# EAGLE schematic PFCEDU.V4 (EAGLE 9.5.0)

## Sheet 1 of 7: Computer
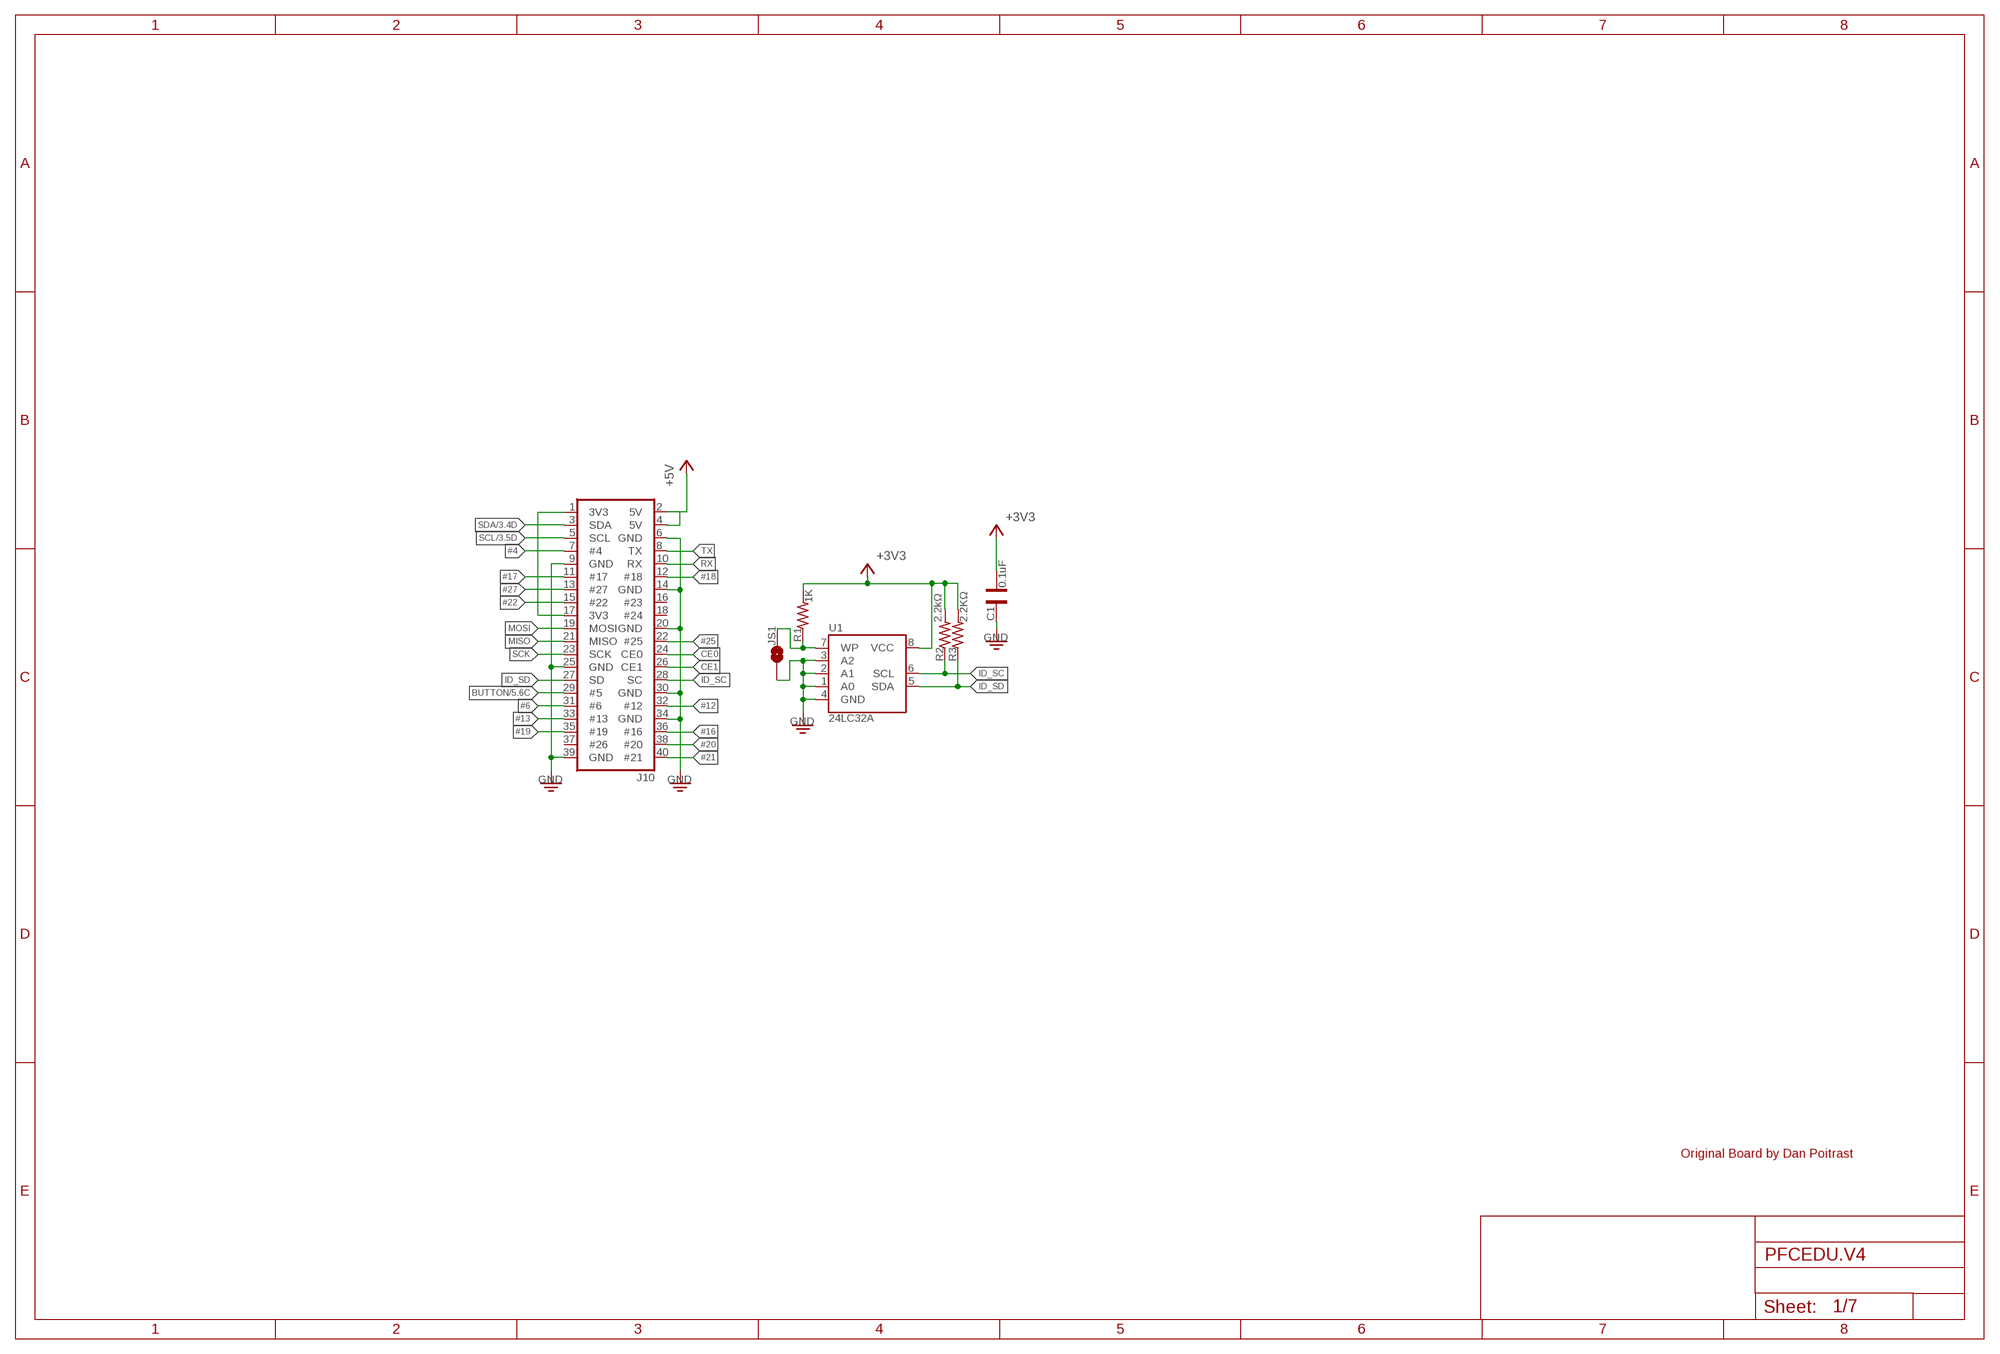
[diagram p0: schematic, sheet 1]

### Parts
C1  0.1uF  CAP0603  [CAP-0603]
J10  PFCEDU_V7_PI4_AI_CONNECTORS_2X20-RPI-NOFIRST  [PFCEDU_V7_PI4_AI_CONNECTORS_2X20-RPI-NOFIRST]
JS1  1X02-SJ-NO  [1X02-SJ-NO]
R1  1K  RES0603  [RES-0603]
R2  2.2kΩ  RES0603  [RES-0603]
R3  2.2KΩ  RES0603  [RES-0603]
U1  24LC32A  [SO08-EIAJ]

### Nets
#4: J10.7(#4)
#6: J10.31(#6)
#12: J10.32(#12)
#13: J10.33(#13)
#16: J10.36(#16)
#17: J10.11(#17)
#18: J10.12(#18)
#19: J10.35(#19)
#20: J10.38(#20)
#21: J10.40(#21)
#22: J10.15(#22)
#25: J10.22(#25)
#27: J10.13(#27)
+3V3: C1.1 R1.2 R2.2 R3.2 U1.8(VCC) ; also sheet 3,4,5,6,7
+5V: J10.2(5V) J10.4(5V) ; also sheet 3,4,7
BUTTON: J10.29(#5) ; also sheet 5
CE0: J10.24(CE0)
CE1: J10.26(CE1)
GND: C1.2 J10.6(GND) J10.9(GND) J10.14(GND) J10.20(GND) J10.25(GND) J10.30(GND) J10.34(GND) J10.39(GND) JS1.1 U1.1(A0) U1.2(A1) U1.3(A2) U1.4(GND) ; also sheet 2,3,4,5,6,7
ID_SC: J10.28(SC) R2.1 U1.6(SCL)
ID_SD: J10.27(SD) R3.1 U1.5(SDA)
MISO: J10.21(MISO)
MOSI: J10.19(MOSI)
N$41: J10.1(3V3) J10.17(3V3)
N$77: JS1.2 R1.1 U1.7(WP)
RX: J10.10(RX)
SCK: J10.23(SCK)
SCL: J10.5(SCL) ; also sheet 3
SDA: J10.3(SDA) ; also sheet 3
TX: J10.8(TX)
Unconnected: J10.16(#23) J10.18(#24) J10.37(#26)

### Notes on the sheet
- Original Board by Dan Poitrast

## Sheet 2 of 7: LED Circuitry
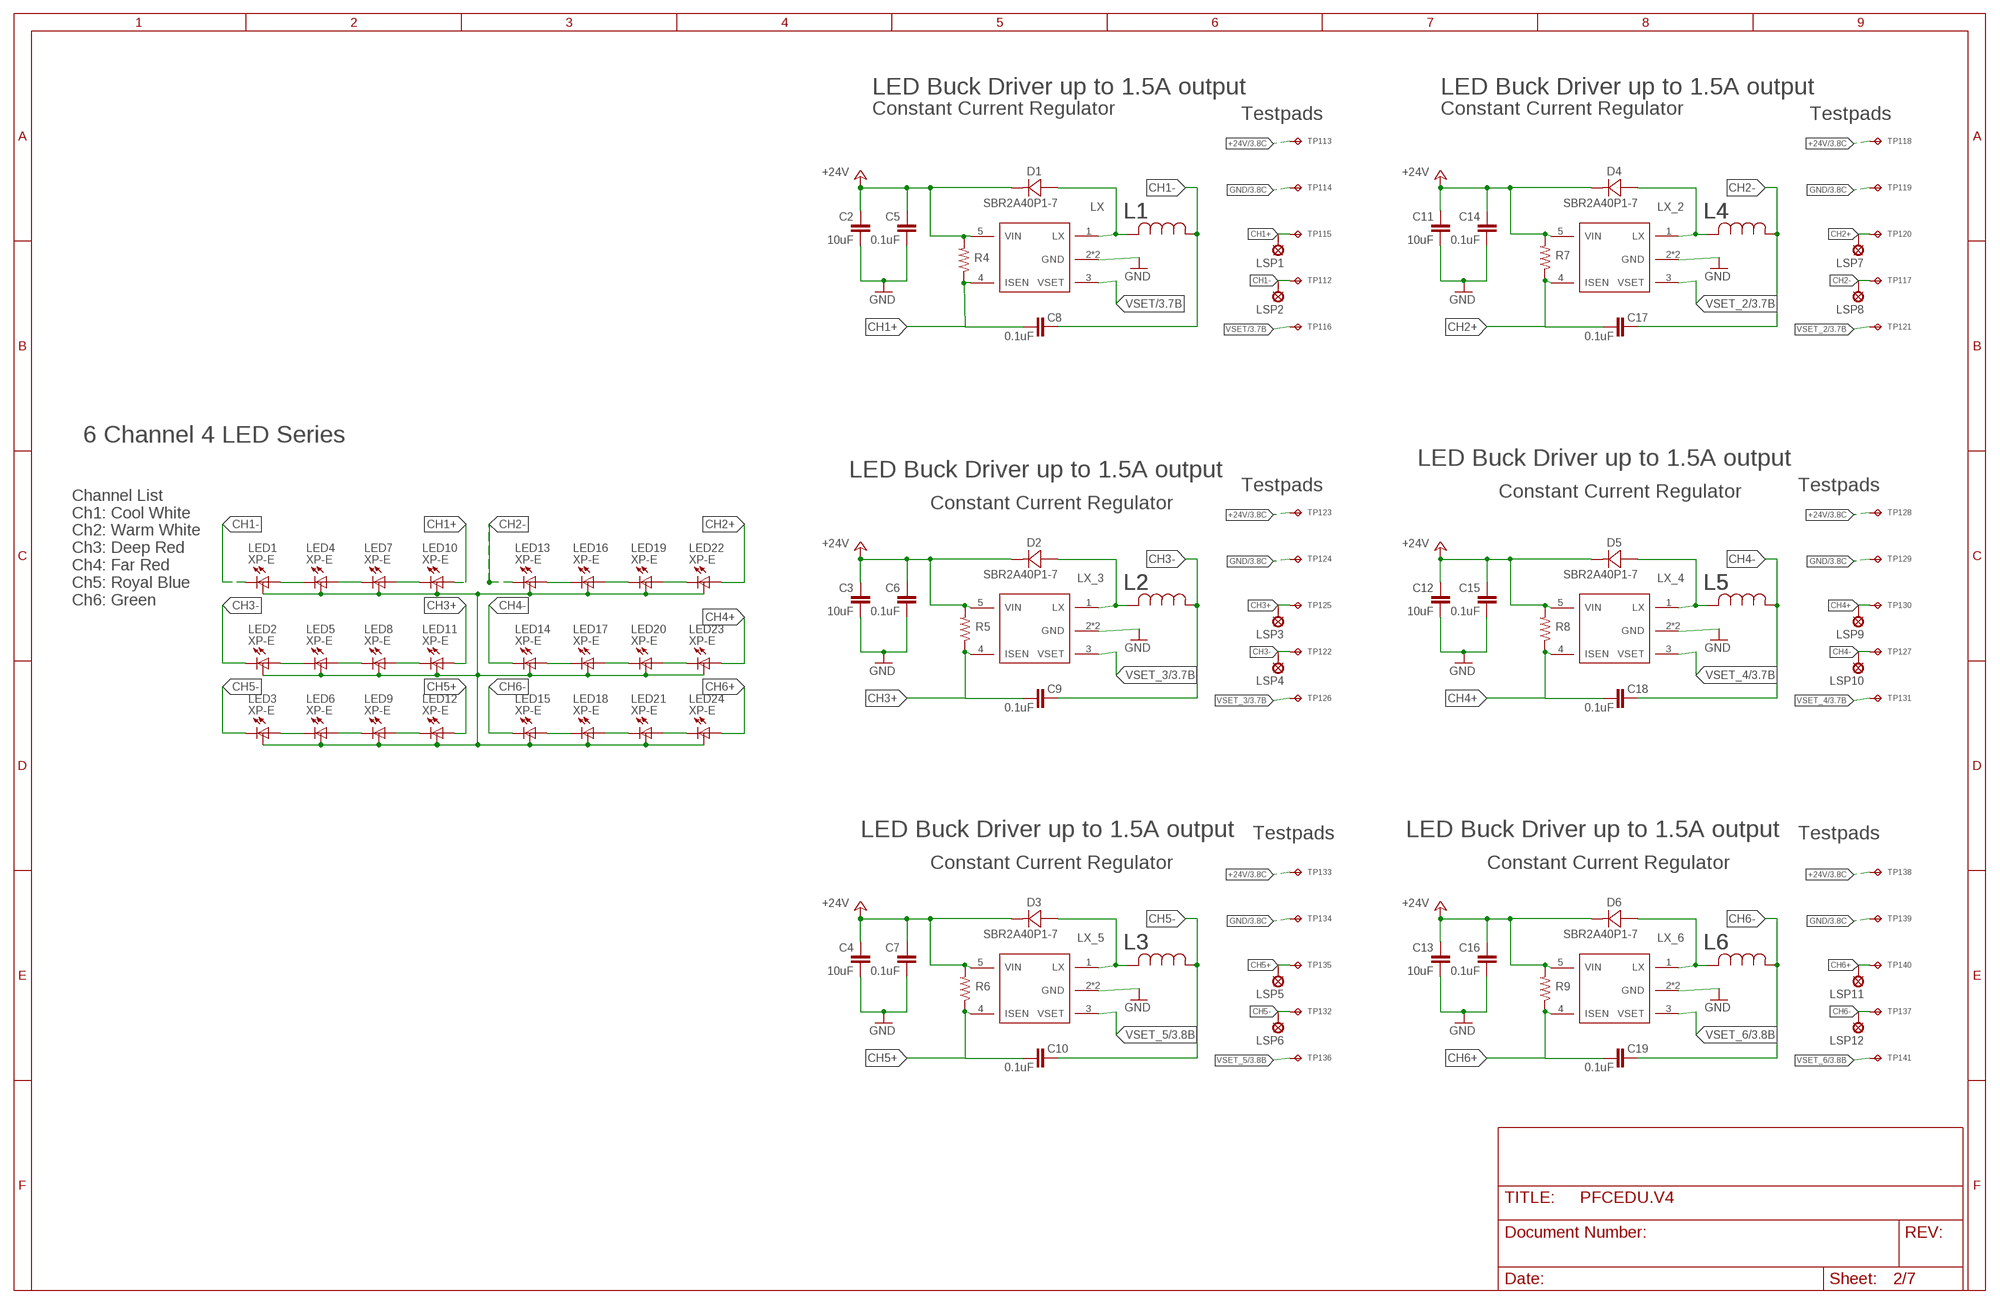
[diagram p1: schematic, sheet 2]

### Parts
C2  10uF  10UF-GMK212BBJ106KG-T  [C0805]
C3  10uF  10UF-GMK212BBJ106KG-T  [C0805]
C4  10uF  10UF-GMK212BBJ106KG-T  [C0805]
C5  0.1uF  0.1UF-C0603C104K5RACTU  [C0603]
C6  0.1uF  0.1UF-C0603C104K5RACTU  [C0603]
C7  0.1uF  0.1UF-C0603C104K5RACTU  [C0603]
C8  0.1uF  0.1UF-C0603C104K5RACTU  [C0603]
C9  0.1uF  0.1UF-C0603C104K5RACTU  [C0603]
C10  0.1uF  0.1UF-C0603C104K5RACTU  [C0603]
C11  10uF  10UF-GMK212BBJ106KG-T  [C0805]
C12  10uF  10UF-GMK212BBJ106KG-T  [C0805]
C13  10uF  10UF-GMK212BBJ106KG-T  [C0805]
C14  0.1uF  0.1UF-C0603C104K5RACTU  [C0603]
C15  0.1uF  0.1UF-C0603C104K5RACTU  [C0603]
C16  0.1uF  0.1UF-C0603C104K5RACTU  [C0603]
C17  0.1uF  0.1UF-C0603C104K5RACTU  [C0603]
C18  0.1uF  0.1UF-C0603C104K5RACTU  [C0603]
C19  0.1uF  0.1UF-C0603C104K5RACTU  [C0603]
D1  SBR2A40P1-7  [POWERDI123]
D2  SBR2A40P1-7  [POWERDI123]
D3  SBR2A40P1-7  [POWERDI123]
D4  SBR2A40P1-7  [POWERDI123]
D5  SBR2A40P1-7  [POWERDI123]
D6  SBR2A40P1-7  [POWERDI123]
L1  NR8040T101M  [IND_TAIYO_NR8040]
L2  NR8040T101M  [IND_TAIYO_NR8040]
L3  NR8040T101M  [IND_TAIYO_NR8040]
L4  NR8040T101M  [IND_TAIYO_NR8040]
L5  NR8040T101M  [IND_TAIYO_NR8040]
L6  NR8040T101M  [IND_TAIYO_NR8040]
LED1  XP-E  LED_W/THERM-XP-E  [CREE-XLAMP-XP-E]
LED2  XP-E  LED_W/THERM-XP-E  [CREE-XLAMP-XP-E]
LED3  XP-E  LED_W/THERM-XP-E  [CREE-XLAMP-XP-E]
LED4  XP-E  LED_W/THERM-XP-E  [CREE-XLAMP-XP-E]
LED5  XP-E  LED_W/THERM-XP-E  [CREE-XLAMP-XP-E]
LED6  XP-E  LED_W/THERM-XP-E  [CREE-XLAMP-XP-E]
LED7  XP-E  LED_W/THERM-XP-E  [CREE-XLAMP-XP-E]
LED8  XP-E  LED_W/THERM-XP-E  [CREE-XLAMP-XP-E]
LED9  XP-E  LED_W/THERM-XP-E  [CREE-XLAMP-XP-E]
LED10  XP-E  LED_W/THERM-XP-E  [CREE-XLAMP-XP-E]
LED11  XP-E  LED_W/THERM-XP-E  [CREE-XLAMP-XP-E]
LED12  XP-E  LED_W/THERM-XP-E  [CREE-XLAMP-XP-E]
LED13  XP-E  LED_W/THERM-XP-E  [CREE-XLAMP-XP-E]
LED14  XP-E  LED_W/THERM-XP-E  [CREE-XLAMP-XP-E]
LED15  XP-E  LED_W/THERM-XP-E  [CREE-XLAMP-XP-E]
LED16  XP-E  LED_W/THERM-XP-E  [CREE-XLAMP-XP-E]
LED17  XP-E  LED_W/THERM-XP-E  [CREE-XLAMP-XP-E]
LED18  XP-E  LED_W/THERM-XP-E  [CREE-XLAMP-XP-E]
LED19  XP-E  LED_W/THERM-XP-E  [CREE-XLAMP-XP-E]
LED20  XP-E  LED_W/THERM-XP-E  [CREE-XLAMP-XP-E]
LED21  XP-E  LED_W/THERM-XP-E  [CREE-XLAMP-XP-E]
LED22  XP-E  LED_W/THERM-XP-E  [CREE-XLAMP-XP-E]
LED23  XP-E  LED_W/THERM-XP-E  [CREE-XLAMP-XP-E]
LED24  XP-E  LED_W/THERM-XP-E  [CREE-XLAMP-XP-E]
LSP1  SE14  [SE14]
LSP2  SE14  [SE14]
LSP3  SE14  [SE14]
LSP4  SE14  [SE14]
LSP5  SE14  [SE14]
LSP6  SE14  [SE14]
LSP7  SE14  [SE14]
LSP8  SE14  [SE14]
LSP9  SE14  [SE14]
LSP10  SE14  [SE14]
LSP11  SE14  [SE14]
LSP12  SE14  [SE14]
R4  6.34 ohm  6.3OHM-RC0805FR-076R34L  [R0805]
R5  6.34 ohm  6.3OHM-RC0805FR-076R34L  [R0805]
R6  6.34 ohm  6.3OHM-RC0805FR-076R34L  [R0805]
R7  6.34 ohm  6.3OHM-RC0805FR-076R34L  [R0805]
R8  6.34 ohm  6.3OHM-RC0805FR-076R34L  [R0805]
R9  6.34 ohm  6.3OHM-RC0805FR-076R34L  [R0805]
TP112  TPTP06R  [TP06R]
TP113  TPTP06R  [TP06R]
TP114  TPTP06R  [TP06R]
TP115  TPTP06R  [TP06R]
TP116  TPTP06R  [TP06R]
TP117  TPTP06R  [TP06R]
TP118  TPTP06R  [TP06R]
TP119  TPTP06R  [TP06R]
TP120  TPTP06R  [TP06R]
TP121  TPTP06R  [TP06R]
TP122  TPTP06R  [TP06R]
TP123  TPTP06R  [TP06R]
TP124  TPTP06R  [TP06R]
TP125  TPTP06R  [TP06R]
TP126  TPTP06R  [TP06R]
TP127  TPTP06R  [TP06R]
TP128  TPTP06R  [TP06R]
TP129  TPTP06R  [TP06R]
TP130  TPTP06R  [TP06R]
TP131  TPTP06R  [TP06R]
TP132  TPTP06R  [TP06R]
TP133  TPTP06R  [TP06R]
TP134  TPTP06R  [TP06R]
TP135  TPTP06R  [TP06R]
TP136  TPTP06R  [TP06R]
TP137  TPTP06R  [TP06R]
TP138  TPTP06R  [TP06R]
TP139  TPTP06R  [TP06R]
TP140  TPTP06R  [TP06R]
TP141  TPTP06R  [TP06R]
U2  AL8861  [AL8861]
U3  AL8861  [AL8861]
U4  AL8861  [AL8861]
U5  AL8861  [AL8861]
U6  AL8861  [AL8861]
U7  AL8861  [AL8861]

### Nets
+24V: C2.1 C3.1 C4.1 C5.1 C6.1 C7.1 C11.1 C12.1 C13.1 C14.1 C15.1 C16.1 D1.- D2.- D3.- D4.- D5.- D6.- R4.2 R5.2 R6.2 R7.2 R8.2 R9.2 TP113.TP TP118.TP TP123.TP TP128.TP TP133.TP TP138.TP U2.5(VIN) U3.5(VIN) U4.5(VIN) U5.5(VIN) U6.5(VIN) U7.5(VIN) ; also sheet 3,4,5,7
CH1+: C8.2 LED10.A LED10.A@1(A) LSP1.MP R4.1 TP115.TP U2.4(ISEN)
CH1-: C8.1 L1.1 LED1.C LED1.C@1(C) LSP2.MP TP112.TP
CH2+: C17.2 LED22.A LED22.A@1(A) LSP7.MP R7.1 TP120.TP U5.4(ISEN)
CH2-: C17.1 L4.1 LED13.C LED13.C@1(C) LSP8.MP TP117.TP
CH3+: C9.2 LED11.A LED11.A@1(A) LSP3.MP R5.1 TP125.TP U3.4(ISEN)
CH3-: C9.1 L2.1 LED2.C LED2.C@1(C) LSP4.MP TP122.TP
CH4+: C18.2 LED23.A LED23.A@1(A) LSP9.MP R8.1 TP130.TP U6.4(ISEN)
CH4-: C18.1 L5.1 LED14.C LED14.C@1(C) LSP10.MP TP127.TP
CH5+: C10.2 LED12.A LED12.A@1(A) LSP5.MP R6.1 TP135.TP U4.4(ISEN)
CH5-: C10.1 L3.1 LED3.C LED3.C@1(C) LSP6.MP TP132.TP
CH6+: C19.2 LED24.A LED24.A@1(A) LSP11.MP R9.1 TP140.TP U7.4(ISEN)
CH6-: C19.1 L6.1 LED15.C LED15.C@1(C) LSP12.MP TP137.TP
GND: C2.2 C3.2 C4.2 C5.2 C6.2 C7.2 C11.2 C12.2 C13.2 C14.2 C15.2 C16.2 TP114.TP TP119.TP TP124.TP TP129.TP TP134.TP TP139.TP U2.2(GND) U2.44(GND) U3.2(GND) U3.44(GND) U4.2(GND) U4.44(GND) U5.2(GND) U5.44(GND) U6.2(GND) U6.44(GND) U7.2(GND) U7.44(GND) ; also sheet 1,3,4,5,6,7
LX: D1.+ L1.2 U2.1(LX)
LX_2: D4.+ L4.2 U5.1(LX)
LX_3: D2.+ L2.2 U3.1(LX)
LX_4: D5.+ L5.2 U6.1(LX)
LX_5: D3.+ L3.2 U4.1(LX)
LX_6: D6.+ L6.2 U7.1(LX)
N$29: LED13.A LED13.A@1(A) LED16.C LED16.C@1(C)
N$31: LED16.A LED16.A@1(A) LED19.C LED19.C@1(C)
N$32: LED19.A LED19.A@1(A) LED22.C LED22.C@1(C)
N$33: LED14.A LED14.A@1(A) LED17.C LED17.C@1(C)
N$34: LED17.A LED17.A@1(A) LED20.C LED20.C@1(C)
N$35: LED20.A LED20.A@1(A) LED23.C LED23.C@1(C)
N$36: LED15.A LED15.A@1(A) LED18.C LED18.C@1(C)
N$37: LED18.A LED18.A@1(A) LED21.C LED21.C@1(C)
N$46: LED21.A LED21.A@1(A) LED24.C LED24.C@1(C)
N$47: LED1.A LED1.A@1(A) LED4.C LED4.C@1(C)
N$48: LED4.A LED4.A@1(A) LED7.C LED7.C@1(C)
N$81: LED7.A LED7.A@1(A) LED10.C LED10.C@1(C)
N$82: LED2.A LED2.A@1(A) LED5.C LED5.C@1(C)
N$83: LED5.A LED5.A@1(A) LED8.C LED8.C@1(C)
N$84: LED8.A LED8.A@1(A) LED11.C LED11.C@1(C)
N$85: LED3.A LED3.A@1(A) LED6.C LED6.C@1(C)
N$159: LED6.A LED6.A@1(A) LED9.C LED9.C@1(C)
N$160: LED9.A LED9.A@1(A) LED12.C LED12.C@1(C)
T1: LED1.THERM LED2.THERM LED3.THERM LED4.THERM LED5.THERM LED6.THERM LED7.THERM LED8.THERM LED9.THERM LED10.THERM LED11.THERM LED12.THERM LED13.THERM LED14.THERM LED15.THERM LED16.THERM LED17.THERM LED18.THERM LED19.THERM LED20.THERM LED21.THERM LED22.THERM LED23.THERM LED24.THERM
VSET: TP116.TP U2.3(VSET) ; also sheet 3
VSET_2: TP121.TP U5.3(VSET) ; also sheet 3
VSET_3: TP126.TP U3.3(VSET) ; also sheet 3
VSET_4: TP131.TP U6.3(VSET) ; also sheet 3
VSET_5: TP136.TP U4.3(VSET) ; also sheet 3
VSET_6: TP141.TP U7.3(VSET) ; also sheet 3

### Notes on the sheet
- LED Buck Driver up to 1.5A output | LED Buck Driver up to 1.5A output
- Constant Current Regulator | Testpads | Constant Current Regulator | Testpads
- 6 Channel 4 LED Series
- LED Buck Driver up to 1.5A output
- LED Buck Driver up to 1.5A output
- Testpads | Testpads
- Constant Current Regulator
- Constant Current Regulator
- Channel List
  Ch1: Cool White
  Ch2: Warm White
  Ch3: Deep Red
  Ch4: Far Red
  Ch5: Royal Blue
  Ch6: Green
- LED Buck Driver up to 1.5A output | Testpads | LED Buck Driver up to 1.5A output | Testpads
- Constant Current Regulator | Constant Current Regulator

## Sheet 3 of 7: Control Circuitry
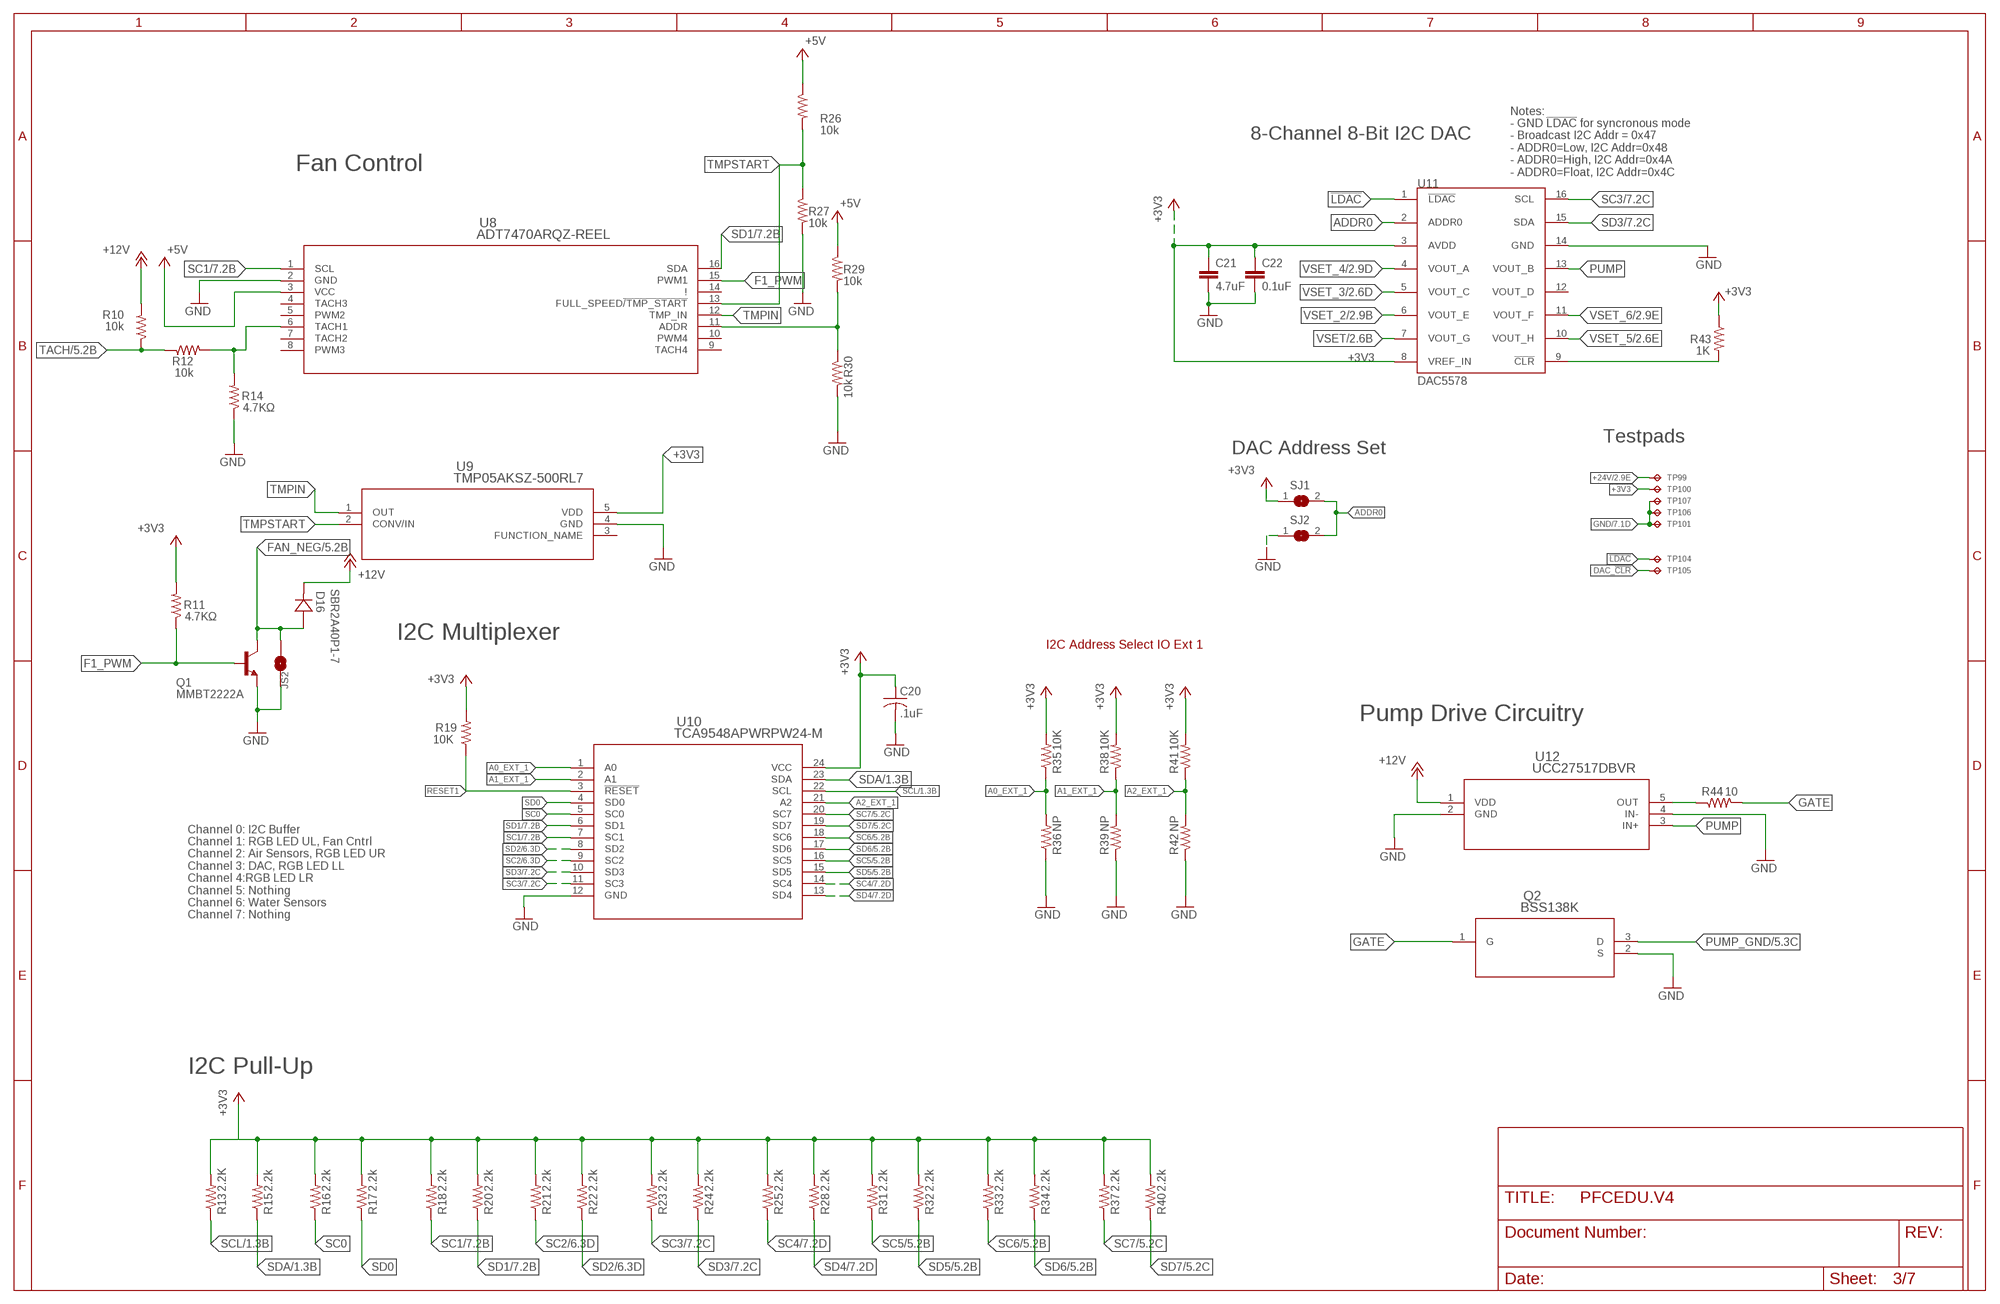
[diagram p2: schematic, sheet 3]

### Parts
C20  .1uF  C-USC0603  [C0603@1]
C21  4.7uF  4.7UF-CL21A475KBQNNNE  [C0805]
C22  0.1uF  0.1UF-C0603C104K5RACTU  [C0603]
D16  SBR2A40P1-7  [POWERDI123]
JS2  1X02-SJ-NO  [1X02-SJ-NO]
Q1  MMBT2222A  BCF30SMD  [SOT23-BEC]
Q2  BSS138K  DMN6140L-13  [SOT-23]
R10  10k  10KOHM-1/10W-1%(0603)0603  [0603-RES]
R11  4.7KΩ  10KOHM-1/10W-1%(0603)0603  [0603-RES]
R12  10k  10KOHM-1/10W-1%(0603)0603  [0603-RES]
R13  2.2K  10KOHM-1/10W-1%(0603)0603  [0603-RES]
R14  4.7KΩ  10KOHM-1/10W-1%(0603)0603  [0603-RES]
R15  2.2k  10KOHM-1/10W-1%(0603)0603  [0603-RES]
R16  2.2k  10KOHM-1/10W-1%(0603)0603  [0603-RES]
R17  2.2k  10KOHM-1/10W-1%(0603)0603  [0603-RES]
R18  2.2k  10KOHM-1/10W-1%(0603)0603  [0603-RES]
R19  10K  R-US_R0603  [R0603]
R20  2.2k  10KOHM-1/10W-1%(0603)0603  [0603-RES]
R21  2.2k  10KOHM-1/10W-1%(0603)0603  [0603-RES]
R22  2.2k  10KOHM-1/10W-1%(0603)0603  [0603-RES]
R23  2.2k  10KOHM-1/10W-1%(0603)0603  [0603-RES]
R24  2.2k  10KOHM-1/10W-1%(0603)0603  [0603-RES]
R25  2.2k  10KOHM-1/10W-1%(0603)0603  [0603-RES]
R26  10k  10KOHM-1/10W-1%(0603)0603  [0603-RES]
R27  10k  10KOHM-1/10W-1%(0603)0603  [0603-RES]
R28  2.2k  10KOHM-1/10W-1%(0603)0603  [0603-RES]
R29  10k  10KOHM-1/10W-1%(0603)0603  [0603-RES]
R30  10k  10KOHM-1/10W-1%(0603)0603  [0603-RES]
R31  2.2k  10KOHM-1/10W-1%(0603)0603  [0603-RES]
R32  2.2k  10KOHM-1/10W-1%(0603)0603  [0603-RES]
R33  2.2k  10KOHM-1/10W-1%(0603)0603  [0603-RES]
R34  2.2k  10KOHM-1/10W-1%(0603)0603  [0603-RES]
R35  10K  10KOHM-1/10W-1%(0603)0603  [0603-RES]
R36  NP  10KOHM-1/10W-1%(0603)0603  [0603-RES]
R37  2.2k  10KOHM-1/10W-1%(0603)0603  [0603-RES]
R38  10K  10KOHM-1/10W-1%(0603)0603  [0603-RES]
R39  NP  10KOHM-1/10W-1%(0603)0603  [0603-RES]
R40  2.2k  10KOHM-1/10W-1%(0603)0603  [0603-RES]
R41  10K  10KOHM-1/10W-1%(0603)0603  [0603-RES]
R42  NP  10KOHM-1/10W-1%(0603)0603  [0603-RES]
R43  1K  1K-ERJ-PB3D1001V  [RC0603N]
R44  10  10KOHM-1/10W-1%(0603)0603  [0603-RES]
SJ1  SOLDERJUMPERREFLOW_NOPASTE  [SJ1]
SJ2  SOLDERJUMPERREFLOW_NOPASTE  [SJ1]
TP99  TPTP04R  [TP04R]
TP100  TPTP04R  [TP04R]
TP101  TPTP04R  [TP04R]
TP104  TPTP04R  [TP04R]
TP105  TPTP04R  [TP04R]
TP106  TPTP04R  [TP04R]
TP107  TPTP04R  [TP04R]
U8  ADT7470ARQZ-REEL  [RQ_16]
U9  TMP05AKSZ-500RL7  [KS_5]
U10  TCA9548APWRPW24-M  [PW24-M]
U11  DAC5578  DAC5578SPW  [TSSOP16]
U12  UCC27517DBVR  [DBV5]

### Nets
!LDAC!: TP104.1(TP) U11.1(!LDAC!)
+3V3: C20.1 C21.1 C22.1 R11.2 R13.2 R15.2 R16.2 R17.2 R18.2 R19.2 R20.2 R21.2 R22.2 R23.2 R24.2 R25.2 R28.2 R31.2 R32.2 R33.2 R34.2 R35.2 R37.2 R38.2 R40.2 R41.2 R43.1 SJ1.1 TP100.1(TP) U9.5(VDD) U10.24(VCC) U11.3(AVDD) U11.8(VREF_IN) ; also sheet 1,4,5,6,7
+5V: R26.1 R29.1 U8.3(VCC) ; also sheet 1,4,7
+12V: D16.- R10.2 U12.1(VDD) ; also sheet 4,5,7
+24V: TP99.1(TP) ; also sheet 2,4,5,7
A0_EXT_1: R35.1 R36.2 U10.1(A0)
A1_EXT_1: R38.1 R39.2 U10.2(A1)
A2_EXT_1: R41.1 R42.2 U10.21(A2)
ADDR0: SJ1.2 SJ2.2 U11.2(ADDR0)
DAC_!CLR!: R43.2 TP105.1(TP) U11.9(!CLR!)
F1_PWM: Q1.B R11.1 U8.15(PWM1)
FAN_NEG: D16.+ JS2.1 Q1.C ; also sheet 5
GATE: Q2.1(G) R44.2
GND: C20.2 C21.2 C22.2 JS2.2 Q1.E Q2.2(S) R14.1 R27.2 R30.2 R36.1 R39.1 R42.1 SJ2.1 TP101.1(TP) TP106.1(TP) TP107.1(TP) U8.2(GND) U9.4(GND) U10.12(GND) U11.14(GND) U12.2(GND) U12.4(IN-) ; also sheet 1,2,4,5,6,7
N$38: R29.2 R30.1 U8.11(ADDR)
N$40: R12.2 R14.2 U8.6(TACH1)
N$75: R44.1 U12.5(OUT)
PUMP: U11.13(VOUT_B) U12.3(IN+)
PUMP_GND: Q2.3(D) ; also sheet 5
RESET1: R19.1 U10.3(!RESET)
SC0: R16.1 U10.5(SC0)
SC1: R18.1 U8.1(SCL) U10.7(SC1) ; also sheet 7
SC2: R21.1 U10.9(SC2) ; also sheet 6,7
SC3: R23.1 U10.11(SC3) U11.16(SCL) ; also sheet 7
SC4: R25.1 U10.14(SC4) ; also sheet 7
SC5: R31.1 U10.16(SC5) ; also sheet 5
SC6: R33.1 U10.18(SC6) ; also sheet 5,6
SC7: R37.1 U10.20(SC7) ; also sheet 5
SCL: R13.1 U10.22(SCL) ; also sheet 1
SD0: R17.1 U10.4(SD0)
SD1: R20.1 U8.16(SDA) U10.6(SD1) ; also sheet 7
SD2: R22.1 U10.8(SD2) ; also sheet 6,7
SD3: R24.1 U10.10(SD3) U11.15(SDA) ; also sheet 7
SD4: R28.1 U10.13(SD4) ; also sheet 7
SD5: R32.1 U10.15(SD5) ; also sheet 5
SD6: R34.1 U10.17(SD6) ; also sheet 5,6
SD7: R40.1 U10.19(SD7) ; also sheet 5
SDA: R15.1 U10.23(SDA) ; also sheet 1
TACH: R10.1 R12.1 ; also sheet 5
TMPIN: U8.12(TMP_IN) U9.1(OUT)
TMPSTART: R26.2 R27.1 U8.13(FULL_SPEED!/TMP_START) U9.2(CONV/IN)
VSET: U11.7(VOUT_G) ; also sheet 2
VSET_2: U11.6(VOUT_E) ; also sheet 2
VSET_3: U11.5(VOUT_C) ; also sheet 2
VSET_4: U11.4(VOUT_A) ; also sheet 2
VSET_5: U11.10(VOUT_H) ; also sheet 2
VSET_6: U11.11(VOUT_F) ; also sheet 2
Unconnected: U8.4(TACH3) U8.5(PWM2) U8.7(TACH2) U8.8(PWM3) U8.9(TACH4) U8.10(PWM4) U8.14(!) U9.3(FUNCTION_NAME) U11.12(VOUT_D)

### Notes on the sheet
- 8-Channel 8-Bit I2C DAC
- Fan Control
- Notes:
  - GND !LDAC! for syncronous mode
  - Broadcast I2C Addr = 0x47
  - ADDR0=Low, I2C Addr=0x48
  - ADDR0=High, I2C Addr=0x4A
  - ADDR0=Float, I2C Addr=0x4C
- Testpads
- DAC Address Set
- I2C Multiplexer | I2C Address Select IO Ext 1
- Pump Drive Circuitry
- Channel 0: I2C Buffer
  Channel 1: RGB LED UL, Fan Cntrl
  Channel 2: Air Sensors, RGB LED UR
  Channel 3: DAC, RGB LED LL
  Channel 4:RGB LED LR
  Channel 5: Nothing
  Channel 6: Water Sensors
  Channel 7: Nothing
- I2C Pull-Up

## Sheet 4 of 7: Power Supply
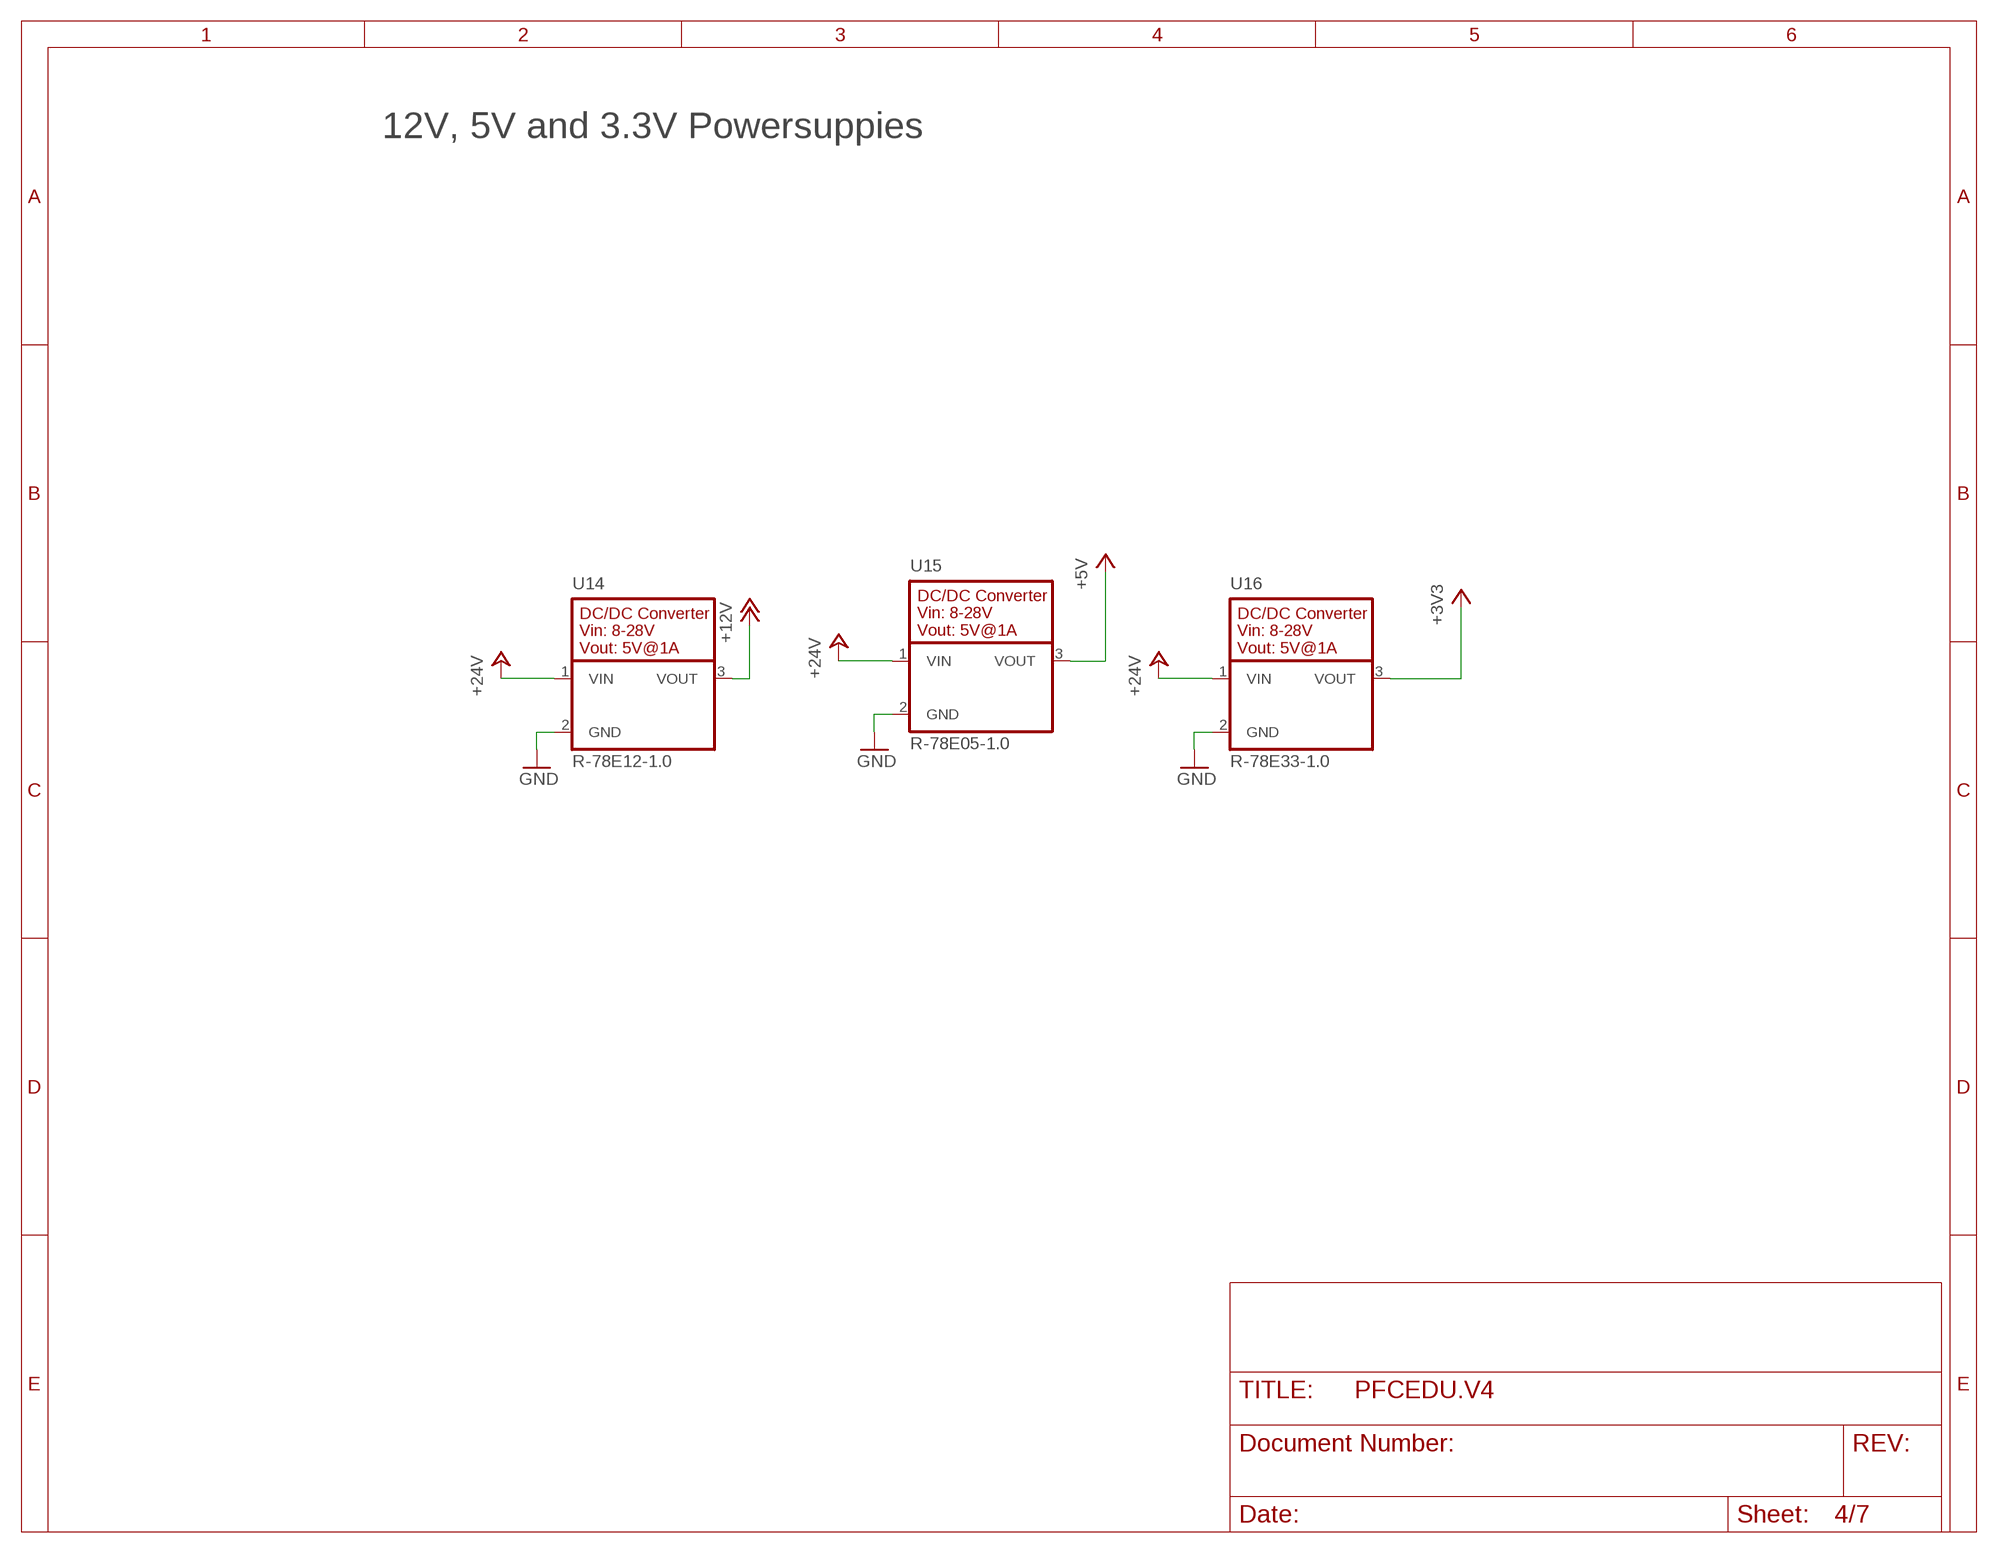
[diagram p3: schematic, sheet 4]

### Parts
U14  R-78E12-1.0  R-78E5.0-1.0  [R-78E5.0-1.0]
U15  R-78E05-1.0  R-78E5.0-1.0  [R-78E5.0-1.0]
U16  R-78E33-1.0  R-78E5.0-1.0  [R-78E5.0-1.0]

### Nets
+3V3: U16.3(VOUT) ; also sheet 1,3,5,6,7
+5V: U15.3(VOUT) ; also sheet 1,3,7
+12V: U14.3(VOUT) ; also sheet 3,5,7
+24V: U14.1(VIN) U15.1(VIN) U16.1(VIN) ; also sheet 2,3,5,7
GND: U14.2(GND) U15.2(GND) U16.2(GND) ; also sheet 1,2,3,5,6,7

### Notes on the sheet
- 12V, 5V and 3.3V Powersuppies

## Sheet 5 of 7: Connectors
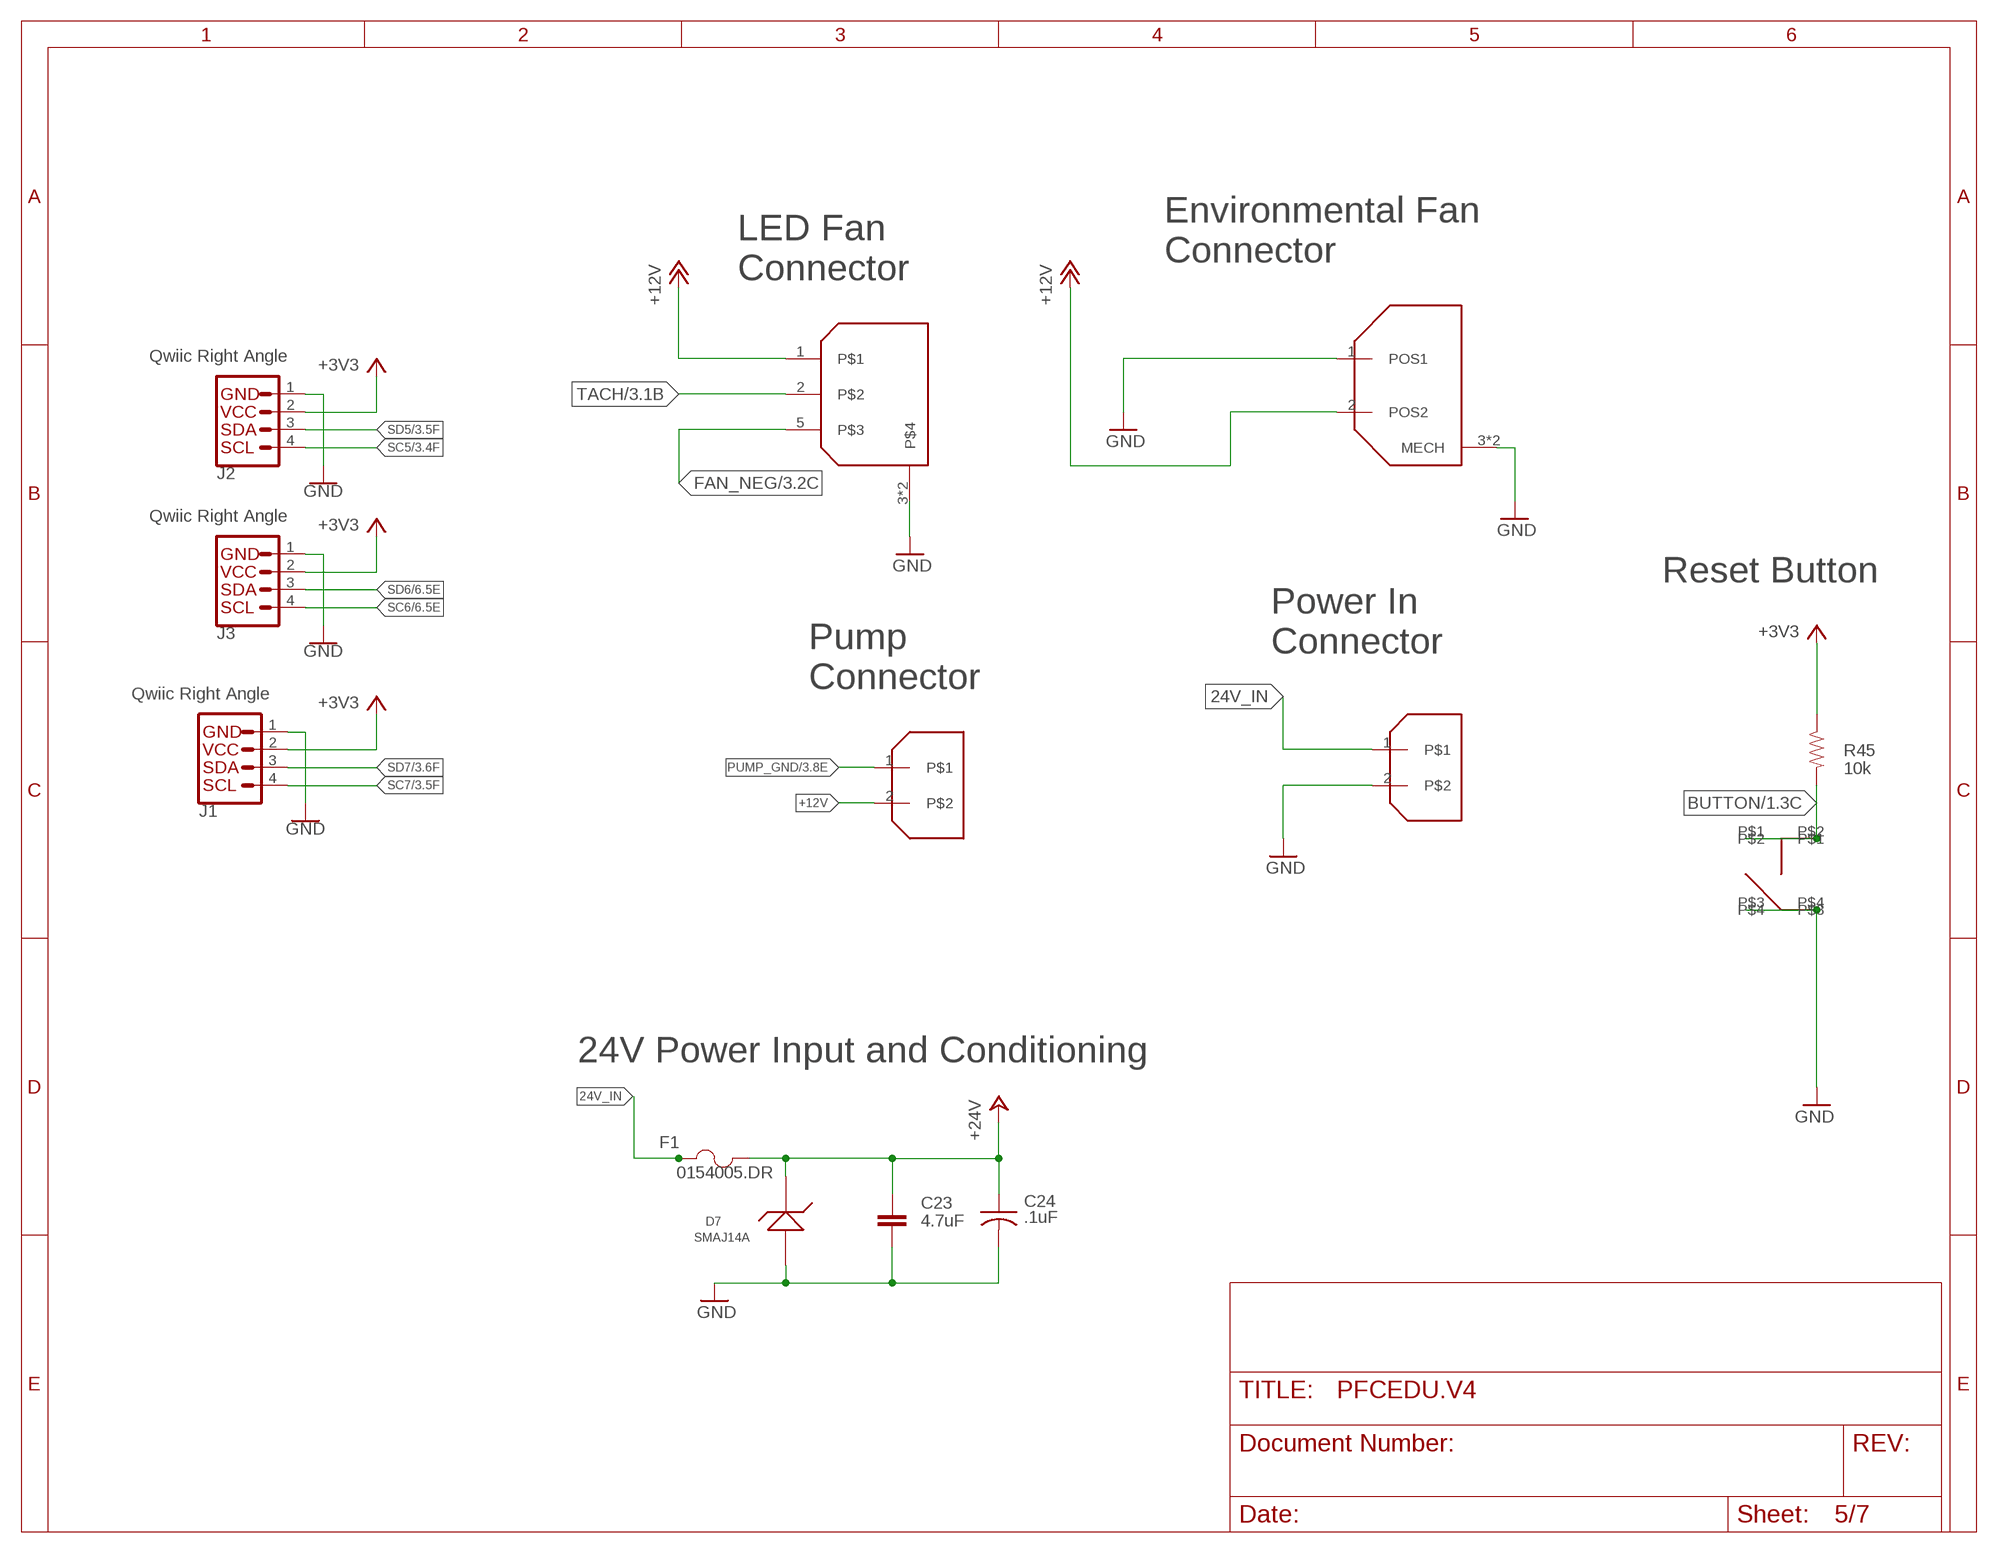
[diagram p4: schematic, sheet 5]

### Parts
A1  PTS645  [PTS645]
C23  4.7uF  4.7UF-CL21A475KBQNNNE  [C0805]
C24  .1uF  C-USC0603  [C0603@1]
D7  SMAJ14A  [DO-214AC]
F1  0154005.DR  [0154SERIES]
J1  Qwiic Right Angle  I2C_STANDARDQWIIC  [1X04_1MM_RA]
J2  Qwiic Right Angle  I2C_STANDARDQWIIC  [1X04_1MM_RA]
J3  Qwiic Right Angle  I2C_STANDARDQWIIC  [1X04_1MM_RA]
J11  MOLEX_2P_1.25MM  [MOLEX_2P_1.25MM]
J12  MOLEX_3P_1.25MM  [MOLEX_3P_1.25MM]
R45  10k  10KOHM-1/10W-1%(0603)0603  [0603-RES]
W11  PHOENIX_2P  [PHOENIX_2P]
W12  PHOENIX_2P  [PHOENIX_2P]

### Nets
24V_IN: F1.1 W12.1
+3V3: J1.2 J2.2 J3.2 R45.1 ; also sheet 1,3,4,6,7
+12V: J11.2(POS2) J12.1 W11.2 ; also sheet 3,4,7
+24V: C23.1 C24.1 D7.C F1.2 ; also sheet 2,3,4,7
BUTTON: A1.P$1 A1.P$2 R45.2 ; also sheet 1
FAN_NEG: J12.5 ; also sheet 3
GND: A1.P$3 A1.P$4 C23.2 C24.2 D7.A J1.1 J2.1 J3.1 J11.1(POS1) J11.3(MECH) J11.4(MECH) J12.3 J12.4 W12.2 ; also sheet 1,2,3,4,6,7
PUMP_GND: W11.1 ; also sheet 3
SC5: J2.4 ; also sheet 3
SC6: J3.4 ; also sheet 3,6
SC7: J1.4 ; also sheet 3
SD5: J2.3 ; also sheet 3
SD6: J3.3 ; also sheet 3,6
SD7: J1.3 ; also sheet 3
TACH: J12.2 ; also sheet 3

### Notes on the sheet
- Environmental Fan
  Connector
- LED Fan
  Connector
- Reset Button
- Power In
  Connector
- Pump 
  Connector
- 24V Power Input and Conditioning

## Sheet 6 of 7: Sensors
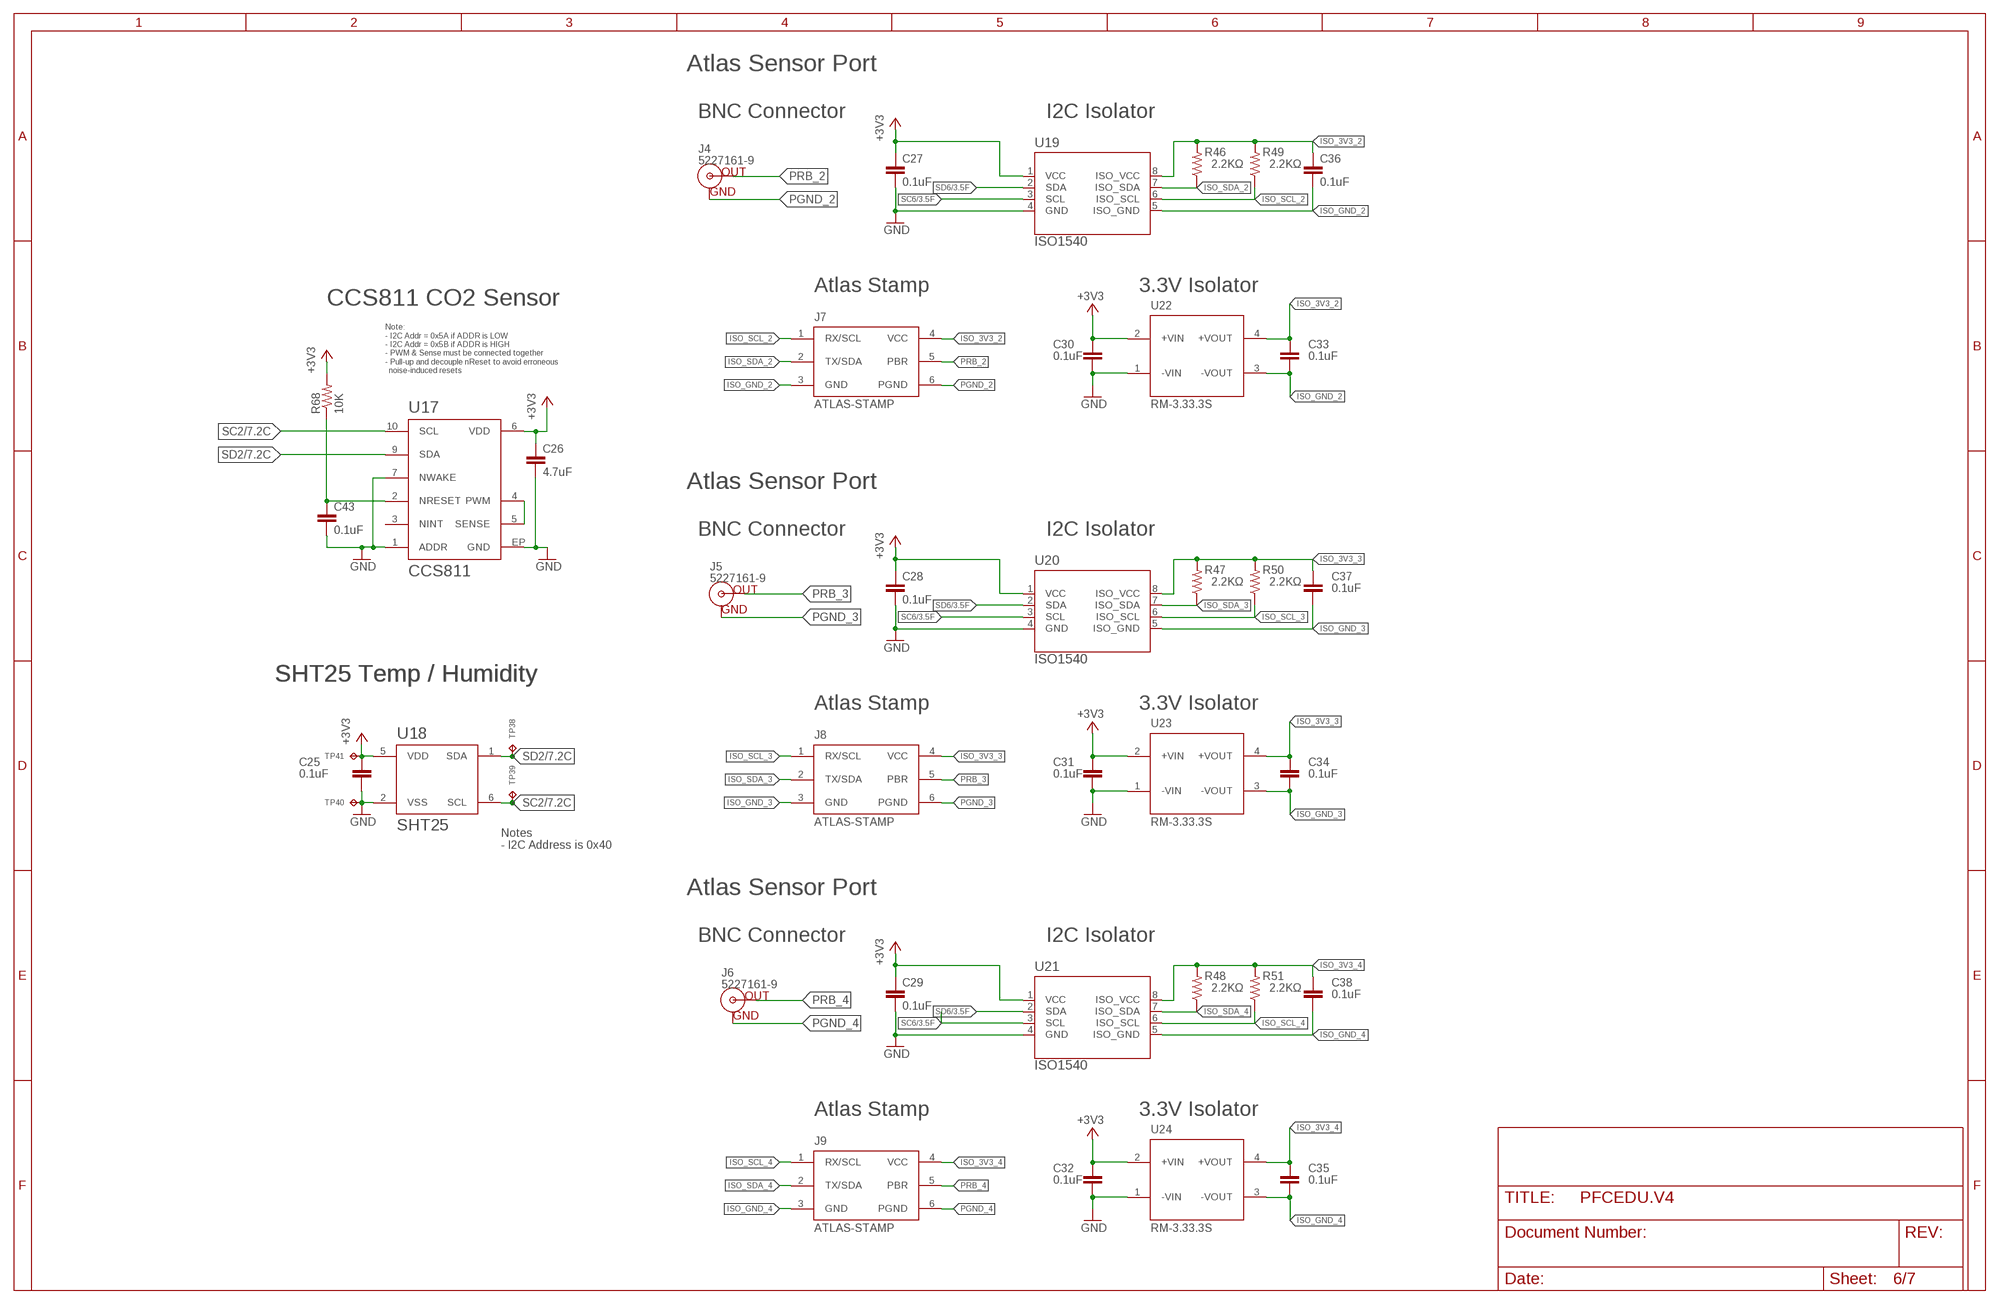
[diagram p5: schematic, sheet 6]

### Parts
C25  0.1uF  0.1UF-C0603C104K5RACTU  [C0603]
C26  4.7uF  4.7UF-CL21A475KBQNNNE  [C0805]
C27  0.1uF  0.1UF-C0603C104K5RACTU  [C0603]
C28  0.1uF  0.1UF-C0603C104K5RACTU  [C0603]
C29  0.1uF  0.1UF-C0603C104K5RACTU  [C0603]
C30  0.1uF  0.1UF-C0603C104K5RACTU  [C0603]
C31  0.1uF  0.1UF-C0603C104K5RACTU  [C0603]
C32  0.1uF  0.1UF-C0603C104K5RACTU  [C0603]
C33  0.1uF  0.1UF-C0603C104K5RACTU  [C0603]
C34  0.1uF  0.1UF-C0603C104K5RACTU  [C0603]
C35  0.1uF  0.1UF-C0603C104K5RACTU  [C0603]
C36  0.1uF  0.1UF-C0603C104K5RACTU  [C0603]
C37  0.1uF  0.1UF-C0603C104K5RACTU  [C0603]
C38  0.1uF  0.1UF-C0603C104K5RACTU  [C0603]
C43  0.1uF  0.1UF-C0603C104K5RACTU  [C0603]
J4  5227161-9  BNC-5227161-9PTH  [BNC-5227161]
J5  5227161-9  BNC-5227161-9PTH  [BNC-5227161]
J6  5227161-9  BNC-5227161-9PTH  [BNC-5227161]
J7  ATLAS-STAMP  [ATLAS-STAMP]
J8  ATLAS-STAMP  [ATLAS-STAMP]
J9  ATLAS-STAMP  [ATLAS-STAMP]
R46  2.2KΩ  1K-ERJ-PB3D1001V  [RC0603N]
R47  2.2KΩ  1K-ERJ-PB3D1001V  [RC0603N]
R48  2.2KΩ  1K-ERJ-PB3D1001V  [RC0603N]
R49  2.2KΩ  1K-ERJ-PB3D1001V  [RC0603N]
R50  2.2KΩ  1K-ERJ-PB3D1001V  [RC0603N]
R51  2.2KΩ  1K-ERJ-PB3D1001V  [RC0603N]
R68  10K  4.7K-RC1206JR-074K7L  [R1206]
TP38  TPTP06R  [TP06R]
TP39  TPTP06R  [TP06R]
TP40  TPTP06R  [TP06R]
TP41  TPTP06R  [TP06R]
U17  CCS811  [CCS811]
U18  SHT25  [SHT2X]
U19  ISO1540  ISO1540DR  [D8]
U20  ISO1540  ISO1540DR  [D8]
U21  ISO1540  ISO1540DR  [D8]
U22  RM-3.33.3S  RM3.33.3S  [RM3.33.3S-SIP4]
U23  RM-3.33.3S  RM3.33.3S  [RM3.33.3S-SIP4]
U24  RM-3.33.3S  RM3.33.3S  [RM3.33.3S-SIP4]

### Nets
+3V3: C25.1 C26.1 C27.1 C28.1 C29.1 C30.1 C31.1 C32.1 R68.2 TP41.TP U17.6(VDD) U18.5(VDD) U19.1(VCC) U20.1(VCC) U21.1(VCC) U22.2(+VIN) U23.2(+VIN) U24.2(+VIN) ; also sheet 1,3,4,5,7
GND: C25.2 C26.2 C27.2 C28.2 C29.2 C30.2 C31.2 C32.2 C43.2 TP40.TP U17.1(ADDR) U17.7(NWAKE) U17.EP(GND) U18.2(VSS) U19.4(GND) U20.4(GND) U21.4(GND) U22.1(-VIN) U23.1(-VIN) U24.1(-VIN) ; also sheet 1,2,3,4,5,7
ISO_3V3_2: C33.1 C36.1 J7.4(VCC) R46.2 R49.2 U19.8(ISO_VCC) U22.4(+VOUT)
ISO_3V3_3: C34.1 C37.1 J8.4(VCC) R47.2 R50.2 U20.8(ISO_VCC) U23.4(+VOUT)
ISO_3V3_4: C35.1 C38.1 J9.4(VCC) R48.2 R51.2 U21.8(ISO_VCC) U24.4(+VOUT)
ISO_GND_2: C33.2 C36.2 J7.3(GND) U19.5(ISO_GND) U22.3(-VOUT)
ISO_GND_3: C34.2 C37.2 J8.3(GND) U20.5(ISO_GND) U23.3(-VOUT)
ISO_GND_4: C35.2 C38.2 J9.3(GND) U21.5(ISO_GND) U24.3(-VOUT)
ISO_SCL_2: J7.1(RX/SCL) R49.1 U19.6(ISO_SCL)
ISO_SCL_3: J8.1(RX/SCL) R50.1 U20.6(ISO_SCL)
ISO_SCL_4: J9.1(RX/SCL) R51.1 U21.6(ISO_SCL)
ISO_SDA_2: J7.2(TX/SDA) R46.1 U19.7(ISO_SDA)
ISO_SDA_3: J8.2(TX/SDA) R47.1 U20.7(ISO_SDA)
ISO_SDA_4: J9.2(TX/SDA) R48.1 U21.7(ISO_SDA)
N$42: U17.4(PWM) U17.5(SENSE)
N$43: C43.1 R68.1 U17.2(NRESET)
PGND_2: J4.GND J7.6(PGND)
PGND_3: J5.GND J8.6(PGND)
PGND_4: J6.GND J9.6(PGND)
PRB_2: J4.S(OUT) J7.5(PBR)
PRB_3: J5.S(OUT) J8.5(PBR)
PRB_4: J6.S(OUT) J9.5(PBR)
SC2: TP39.TP U17.10(SCL) U18.6(SCL) ; also sheet 3,7
SC6: U19.3(SCL) U20.3(SCL) U21.3(SCL) ; also sheet 3,5
SD2: TP38.TP U17.9(SDA) U18.1(SDA) ; also sheet 3,7
SD6: U19.2(SDA) U20.2(SDA) U21.2(SDA) ; also sheet 3,5
Unconnected: U17.3(NINT)

### Notes on the sheet
- Atlas Sensor Port
- BNC Connector | I2C Isolator
- Atlas Stamp | 3.3V Isolator
- CCS811 CO2 Sensor
- Note:
  - I2C Addr = 0x5A if ADDR is LOW
  - I2C Addr = 0x5B if ADDR is HIGH
  - PWM & Sense must be connected together
  - Pull-up and decouple nReset to avoid erroneous
    noise-induced resets
- Atlas Sensor Port
- BNC Connector | I2C Isolator
- SHT25 Temp / Humidity | SHT25 Temp / Humidity
- Atlas Stamp | 3.3V Isolator
- Notes
  - I2C Address is 0x40
- Atlas Sensor Port
- BNC Connector | I2C Isolator
- Atlas Stamp | 3.3V Isolator

## Sheet 7 of 7: Indicators
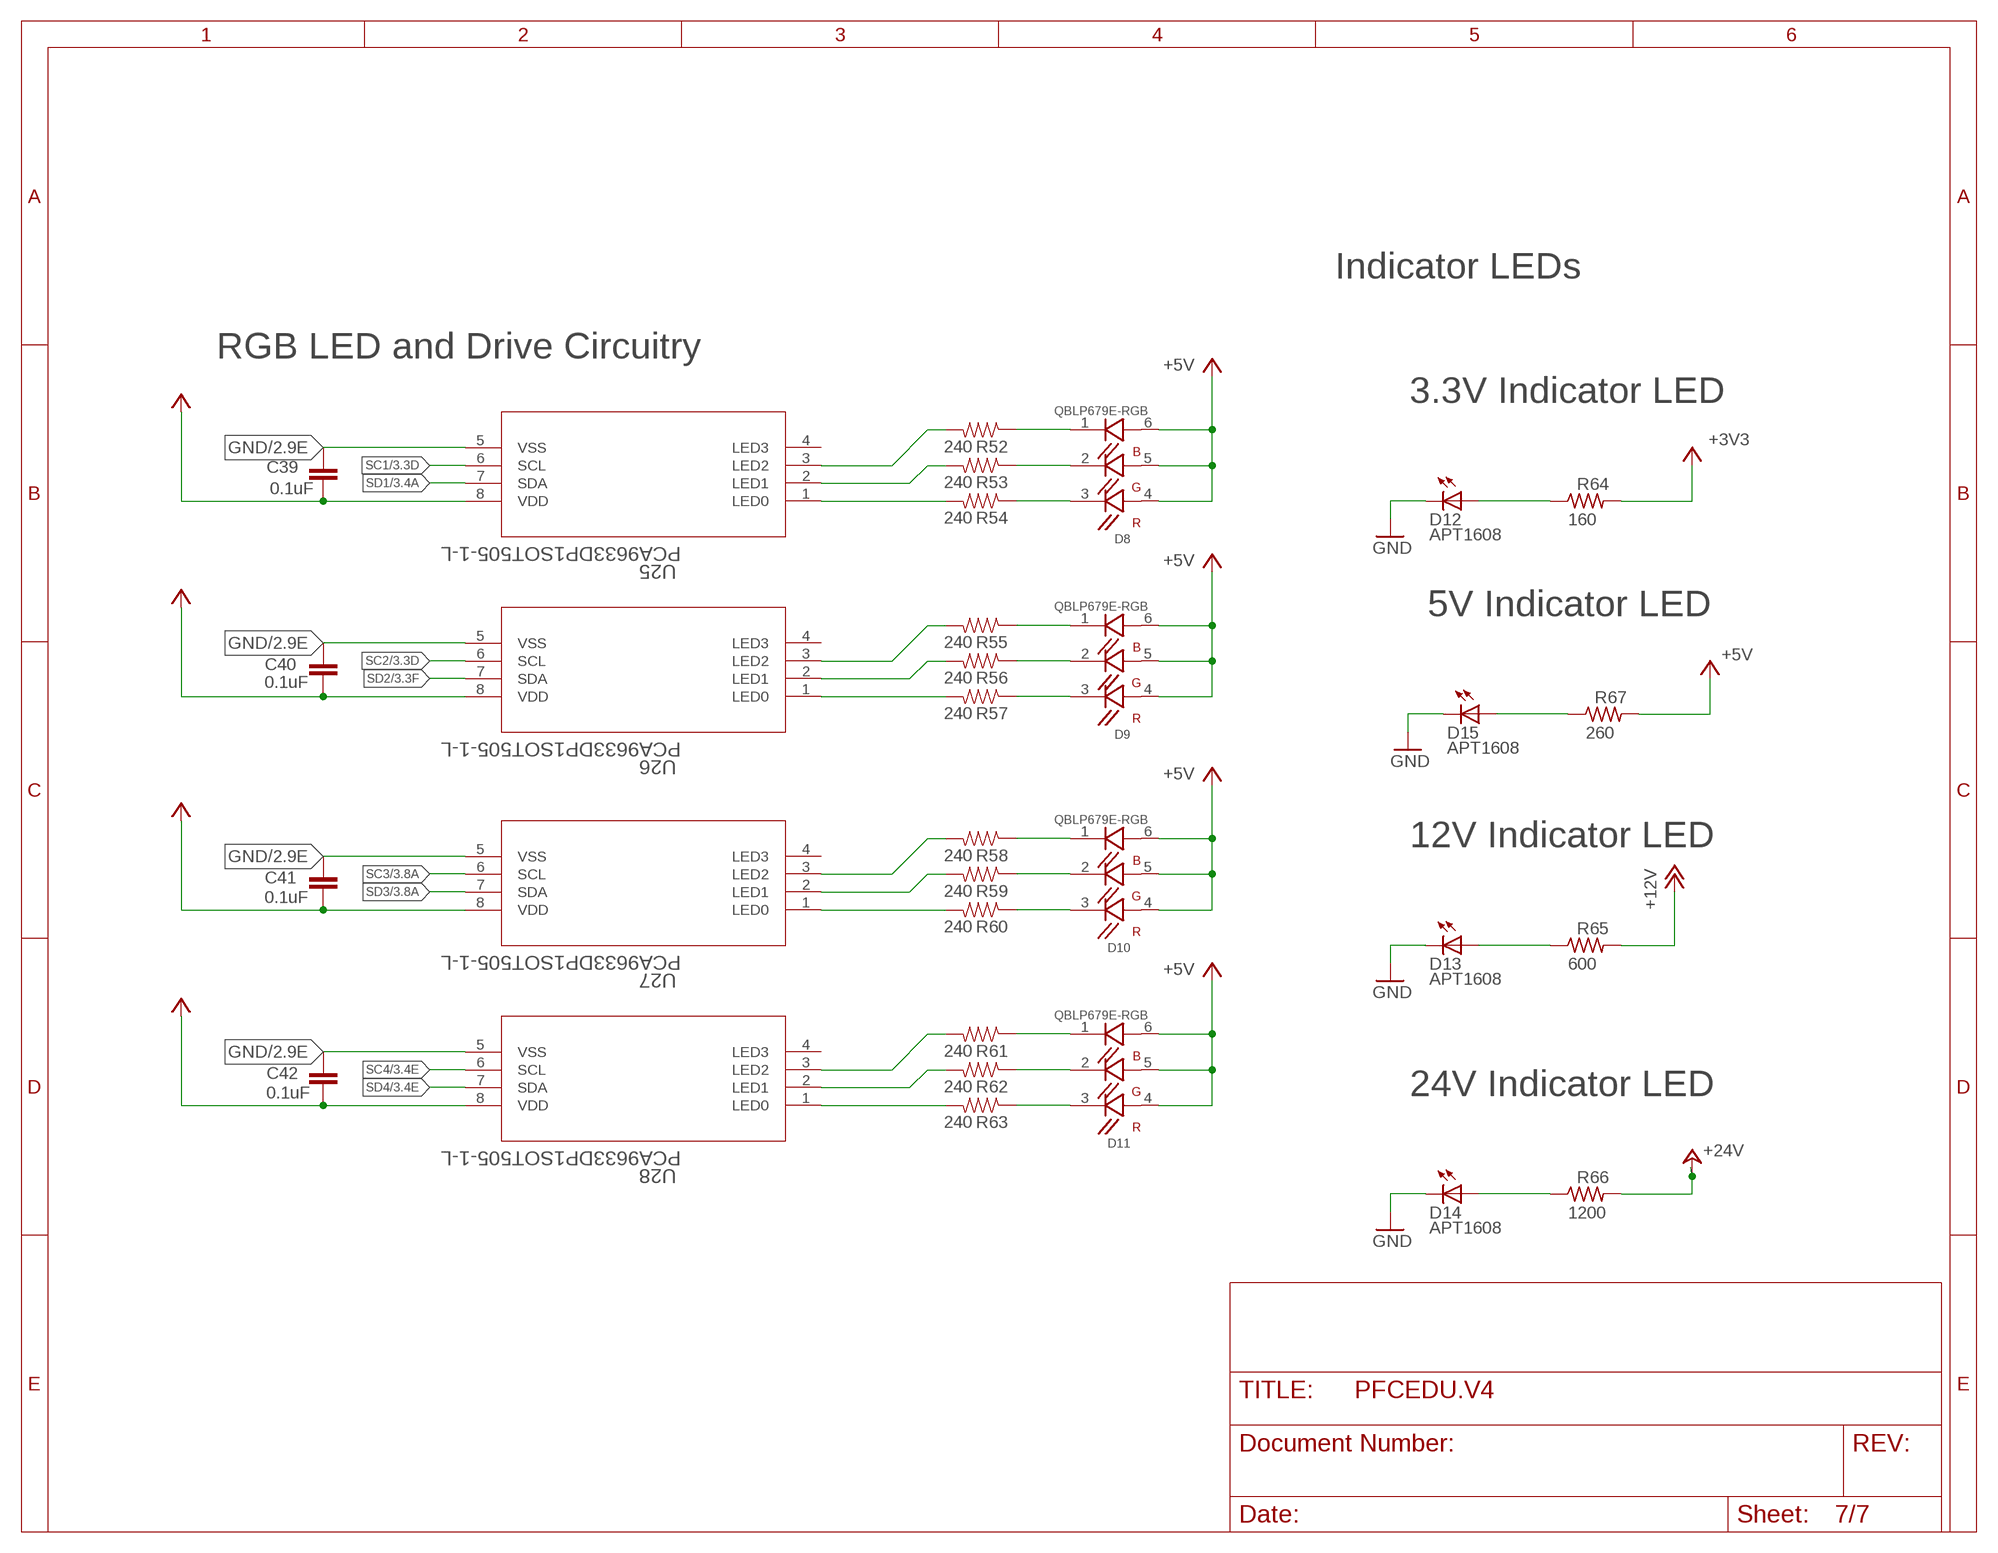
[diagram p6: schematic, sheet 7]

### Parts
C39  0.1uF  0.1UF-C0603C104K5RACTU  [C0603]
C40  0.1uF  0.1UF-C0603C104K5RACTU  [C0603]
C41  0.1uF  0.1UF-C0603C104K5RACTU  [C0603]
C42  0.1uF  0.1UF-C0603C104K5RACTU  [C0603]
D8  QBLP679E-RGB  [LED_QBLP679E-RGB]
D9  QBLP679E-RGB  [LED_QBLP679E-RGB]
D10  QBLP679E-RGB  [LED_QBLP679E-RGB]
D11  QBLP679E-RGB  [LED_QBLP679E-RGB]
D12  APT1608  APT1608CGCK  [CHIPLED_0603]
D13  APT1608  APT1608CGCK  [CHIPLED_0603]
D14  APT1608  APT1608CGCK  [CHIPLED_0603]
D15  APT1608  APT1608CGCK  [CHIPLED_0603]
R52  240  10KOHM-1/10W-1%(0603)0603  [0603-RES]
R53  240  10KOHM-1/10W-1%(0603)0603  [0603-RES]
R54  240  10KOHM-1/10W-1%(0603)0603  [0603-RES]
R55  240  10KOHM-1/10W-1%(0603)0603  [0603-RES]
R56  240  10KOHM-1/10W-1%(0603)0603  [0603-RES]
R57  240  10KOHM-1/10W-1%(0603)0603  [0603-RES]
R58  240  10KOHM-1/10W-1%(0603)0603  [0603-RES]
R59  240  10KOHM-1/10W-1%(0603)0603  [0603-RES]
R60  240  10KOHM-1/10W-1%(0603)0603  [0603-RES]
R61  240  10KOHM-1/10W-1%(0603)0603  [0603-RES]
R62  240  10KOHM-1/10W-1%(0603)0603  [0603-RES]
R63  240  10KOHM-1/10W-1%(0603)0603  [0603-RES]
R64  160  100OHM-RC0603JR-07100RL  [RC0603N]
R65  600  100OHM-RC0603JR-07100RL  [RC0603N]
R66  1200  100OHM-RC0603JR-07100RL  [RC0603N]
R67  260  100OHM-RC0603JR-07100RL  [RC0603N]
U25  PCA9633DP1SOT505-1-L  [SOT505-1-L]
U26  PCA9633DP1SOT505-1-L  [SOT505-1-L]
U27  PCA9633DP1SOT505-1-L  [SOT505-1-L]
U28  PCA9633DP1SOT505-1-L  [SOT505-1-L]

### Nets
+3V3: C39.2 C40.2 C41.2 C42.2 R64.2 U25.8(VDD) U26.8(VDD) U27.8(VDD) U28.8(VDD) ; also sheet 1,3,4,5,6
+5V: D8.4(RA) D8.5(GA) D8.6(BA) D9.4(RA) D9.5(GA) D9.6(BA) D10.4(RA) D10.5(GA) D10.6(BA) D11.4(RA) D11.5(GA) D11.6(BA) R67.2 ; also sheet 1,3,4
+12V: R65.2 ; also sheet 3,4,5
+24V: R66.2 ; also sheet 2,3,4,5
GND: C39.1 C40.1 C41.1 C42.1 D12.C D13.C D14.C D15.C U25.5(VSS) U26.5(VSS) U27.5(VSS) U28.5(VSS) ; also sheet 1,2,3,4,5,6
N$1: R54.2 U25.1(LED0)
N$2: D15.A R67.1
N$3: R53.2 U25.2(LED1)
N$4: D14.A R66.1
N$5: R52.2 U25.3(LED2)
N$6: D8.3(RC) R54.1
N$7: D8.2(GC) R53.1
N$8: D8.1(BC) R52.1
N$9: R63.2 U28.1(LED0)
N$10: R62.2 U28.2(LED1)
N$11: R61.2 U28.3(LED2)
N$12: D12.A R64.1
N$13: D11.3(RC) R63.1
N$14: D11.2(GC) R62.1
N$15: D11.1(BC) R61.1
N$16: R60.2 U27.1(LED0)
N$17: R59.2 U27.2(LED1)
N$18: R58.2 U27.3(LED2)
N$19: D10.3(RC) R60.1
N$20: D10.2(GC) R59.1
N$21: D10.1(BC) R58.1
N$22: R57.2 U26.1(LED0)
N$23: R56.2 U26.2(LED1)
N$24: R55.2 U26.3(LED2)
N$25: D9.3(RC) R57.1
N$26: D9.2(GC) R56.1
N$27: D9.1(BC) R55.1
N$39: D13.A R65.1
SC1: U25.6(SCL) ; also sheet 3
SC2: U26.6(SCL) ; also sheet 3,6
SC3: U27.6(SCL) ; also sheet 3
SC4: U28.6(SCL) ; also sheet 3
SD1: U25.7(SDA) ; also sheet 3
SD2: U26.7(SDA) ; also sheet 3,6
SD3: U27.7(SDA) ; also sheet 3
SD4: U28.7(SDA) ; also sheet 3
Unconnected: U25.4(LED3) U26.4(LED3) U27.4(LED3) U28.4(LED3)

### Notes on the sheet
- Indicator LEDs
- RGB LED and Drive Circuitry
- 3.3V Indicator LED
- 5V Indicator LED
- 12V Indicator LED
- 24V Indicator LED

## Library data of the parts
A1 = openag-connectors:PTS645
C1 = Ai_Passives:CAP; DIELECTRIC: X7R
C2-C4 C11-C13 = openag-capacitors:10UF-GMK212BBJ106KG-T: CAP CER 10UF 35V X5R 0805 Description: 10µF ±10% 35V Ceramic Capacitor X5R 0805 (2012 Metric) Technical Specifications: Capacitance: 10µF Tolerance: ±10% Rated Voltage: 35V Temperature Coefficient: X5R Operating Temperature: -55°C ~ 85°C Package / Case: 0805 (2012 Metric) Datasheet(s): GMK212BBJ106KG-T Spec <http://ds.yuden.co.jp/TYCOMPAS/ut/detail.do?productNo=GMK212BBJ106KG-T&fileName=GMK212BBJ106KG-T_SS&mode=specSheetDownload> Vendor(s): Digikey: 587-4893-1-ND <https://www.digikey.com/product-detail/en/taiyo-yuden/GMK212BBJ106KG-T/587-4893-1-ND/6563736>; MANUFACTURER: Taiyo Yuden; MPN: GMK212BBJ106KG-T; VENDOR: Digikey; VLINK: https://www.digikey.com/product-detail/en/taiyo-yuden/GMK212BBJ106KG-T/587-4893-1-ND/6563736; VPN: 587-4893-1-ND
C5-C10 C14-C19 C22 C25 C27-C42 = openag-capacitors:0.1UF-C0603C104K5RACTU: CAP CER 0.1UF 50V X7R 0603 Description: 0.1µF ±10% 50V Ceramic Capacitor X7R 0603 (1608 Metric) Technical Specifications: Capacitance: 0.1µF Tolerance: ±10% Rated Voltage: 50V Temperature Coefficient: X7R Operating Temperature: -55°C ~ 125°C Package / Case: 0603 (1608 Metric) Datasheet(s): X7R Dielectric, 6.3-250 VDC <https://search.kemet.com/component-edge/download/datasheet/C0603C104K5RACTU.pdf> Vendor(s): Digikey: 399-5089-1-ND <https://www.digikey.com/product-detail/en/kemet/C0603C104K5RACTU/399-5089-1-ND/1465623>; MANUFACTURER: Kemet; MPN: C0603C104K5RACTU; VENDOR: Digikey; VLINK: https://www.digikey.com/product-detail/en/kemet/C0603C104K5RACTU/399-5089-1-ND/1465623; VPN: 399-5089-1-ND
C20 C24 = rcl:C-US: CAPACITOR, American symbol
C21 C23 = openag-capacitors:4.7UF-CL21A475KBQNNNE: CAP CER 4.7UF 50V X5R 0805 Description: 4.7µF ±10% 50V Ceramic Capacitor X5R 0805 (2012 Metric) Technical Specifications: Capacitance: 4.7uF Tolerance: ±10% Rated Voltage: 50V Temperature Coefficient: X5R Operating Temperature: -55°C ~ 85°C Package/Case: 0805 (2012 Metric) Datasheet(s): CL21A475KBQNNNE Characteristics <http://www.samsungsem.com/kr/front/downloadcms.do?path=/kr/support/product-search/mlcc/__icsFiles/afieldfile/2014/11/05&fileName=C_CL21A475KBQNNNE.pdf> Vendor(s): Digikey: 1276-1248-1-ND <https://www.digikey.com/product-detail/en/samsung-electro-mechanics/CL21A475KBQNNNE/1276-1248-1-ND/3889334>; MANUFACTURER: Samsung; MPN: CL21A475KBQNNNE; VENDOR: Digikey; VLINK: https://www.digikey.com/product-detail/en/samsung-electro-mechanics/CL21A475KBQNNNE/1276-1248-1-ND/3889334; VPN: 1276-1248-1-ND
C26 = openag-capacitors:4.7UF-CL21A475KBQNNNE: Samsung - CL21A475KBQNNNE - CAP CER 4.7UF 50V X5R 0805 Description: 4.7µF ±10% 50V Ceramic Capacitor X5R 0805 (2012 Metric) Technical Specifications: Capacitance: 4.7uF Tolerance: ±10% Rated Voltage: 50V Temperature Coefficient: X5R Operating Temperature: -55°C ~ 85°C Package/Case: 0805 (2012 Metric) Datasheet(s): CL21A475KBQNNNE Characteristics <http://www.samsungsem.com/kr/front/downloadcms.do?path=/kr/support/product-search/mlcc/__icsFiles/afieldfile/2014/11/05&fileName=C_CL21A475KBQNNNE.pdf> Vendor(s): Digikey: 1276-1248-1-ND <https://www.digikey.com/product-detail/en/samsung-electro-mechanics/CL21A475KBQNNNE/1276-1248-1-ND/3889334>; POPULATE: YES; VERIFIED: NO
C43 = openag-capacitors:0.1UF-C0603C104K5RACTU: Kemet - C0603C104K5RACTU - CAP CER 0.1UF 50V X7R 0603 Description: 0.1µF ±10% 50V Ceramic Capacitor X7R 0603 (1608 Metric) Technical Specifications: Capacitance: 0.1µF Tolerance: ±10% Rated Voltage: 50V Temperature Coefficient: X7R Operating Temperature: -55°C ~ 125°C Package / Case: 0603 (1608 Metric) Datasheet(s): X7R Dielectric, 6.3-250 VDC <https://search.kemet.com/component-edge/download/datasheet/C0603C104K5RACTU.pdf> Vendor(s): Digikey: 399-5089-1-ND <https://www.digikey.com/product-detail/en/kemet/C0603C104K5RACTU/399-5089-1-ND/1465623>; POPULATE: YES; VERIFIED: NO
D1-D6 D16 = openag-diodes:SBR2A40P1-7: DIODE SBR 40V 2A POWERDI123 Description: Diode Super Barrier 40V 2A Surface Mount PowerDI™ 123 Technical Specifications: Diode Type: Super Barrier Voltage - DC Reverse (Vr) (Max): 40V Current - Average Rectified (Io): 2A Voltage - Forward (Vf) (Max) @ If: 500mV @ 2A Speed: Standard Recovery >500ns, > 200mA (Io) Current - Reverse Leakage @ Vr: 100µA @ 40V Mounting Type: Surface Mount Package / Case: POWERDI®123 Supplier Device Package: PowerDI™ 123 Operating Temperature - Junction: -65°C ~ 150°C Base Part Number: SBR2A40 Datasheet(s): SBR2A40P1 <https://www.diodes.com/assets/Datasheets/SBR2A40P1.pdf> Vendor(s): Digikey: SBR2A40P1DITR-ND <https://www.digikey.com/product-detail/en/diodes-incorporated/SBR2A40P1-7/SBR2A40P1DITR-ND/1681825>; MANUFACTURER: Diodes Incorporated; MPN: SBR2A40P1-7; VENDOR: Digikey; VLINK: https://www.digikey.com/product-detail/en/diodes-incorporated/SBR2A40P1-7/SBR2A40P1DITR-ND/1681825; VPN: SBR2A40P1DITR-ND
D7 = openag-diodes:SMAJ14A: TVS DIODE 14VWM 23.2VC SMA - Littlefuse - SMAJ14A - SMAJ14ALFCT-ND Description: The SMAJ series is designed specifically to protect sensitive electronic equipment from voltage transients induced by lightning and other transient voltage events Technical Specifications: Type: Zener Voltage - Reverse Standoff (Typ): 14V Voltage - Breakdown (Min): 15.6V Voltage - Clamping (Max) @ Ipp: 23.2V Current - Peak Pulse (10/1000µs): 17.2A Operating Temperature: -55°C ~ 150°C (TJ) Mounting Type: Surface Mount Package / Case: DO-214AC, SMA Datasheet(s): SMAJ Series <http://www.littelfuse.com/~/media/electronics/datasheets/tvs_diodes/littelfuse_tvs_diode_smaj_datasheet.pdf.pdf> Vendor(s): Digikey: SMAJ14ALFCT-ND <https://www.digikey.com/product-detail/en/littelfuse-inc/SMAJ14A/SMAJ14ALFCT-ND/762486>; POPULATE: YES; VERIFIED: NO
D8-D11 = QBLP679E-RGB:QBLP679E-RGB: LED RGB DIFFUSED 6SMD; DESCRIPTION: Led Rgb Diffused 6smd; DIGI-KEY_PART_NUMBER: 1516-1131-1-ND; DIGI-KEY_PURCHASE_URL: https://www.digikey.com/product-detail/en/qt-brightek-qtb/QBLP679E-RGB/1516-1131-1-ND/4814858?utm_source=snapeda&utm_medium=aggregator&utm_campaign=symbol; MF: QT Brightek; MP: QBLP679E-RGB; PACKAGE: PLCC-6 QT Brightek
D12-D15 = openag-diodes:APT1608CGCK: LED GREEN CLEAR 0603 SMD Description: Green 570nm LED Indication - Discrete 2.1V 0603 (1608 Metric) Technical Specifications: Color: Green Lens Color: Colorless Lens Transparency: Clear Millicandela Rating: 50mcd Lens Style/Size: Rectangle with Flat Top, 1.20mm x 0.80mm Voltage - Forward (Vf) (Typ): 2.1V Current - Test: 20mA Viewing Angle: 120° Mounting Type: Surface Mount Wavelength - Dominant: 570nm Wavelength - Peak: 574nm Package / Case: 0603 (1608 Metric) Supplier Device Package: Chip LED Size / Dimension: 1.60mm L x 0.80mm W Height (Max): 0.75mm Datasheet(s): APT1608CGCK <http://www.kingbrightusa.com/images/catalog/SPEC/APT1608CGCK.pdf> Vendor(s): Digikey: 754-1116-1-ND <https://www.digikey.com/product-detail/en/kingbright/APT1608CGCK/754-1116-1-ND/1747833#>; MANUFACTURER: Kingbright; MPN: APT1608CGCK; VENDOR: Digikey; VLINK: https://www.digikey.com/product-detail/en/kingbright/APT1608CGCK/754-1116-1-ND/1747833#; VPN: 754-1116-1-ND
F1 = openag-fuses:0154005.DR; MANUFACTURER_PART_NUMBER: 0154005.DR; VENDOR: Littelfuse Inc
J1-J3 = SparkFun-Connectors:I2C_STANDARD: SparkFun I2C Standard Pinout Header SparkFun has standardized on a pinout for all I2C based sensor breakouts. This pinout allows I2C boards to be plugged directly into the headers on Arduino Uno compatible boards, and to be daisy chained easily. Example SparkFun Products: SparkFun Atmospheric Sensor Breakout - BME280 <https://www.sparkfun.com/products/13676> SparkFun Altitude/Pressure Sensor Breakout - MPL3115A2 <https://www.sparkfun.com/products/11084> SparkFun TOF Range Finder Sensor - VL6180 <https://www.sparkfun.com/products/12785>; PROD_ID: CONN-13694
J4-J6 = openag-connectors:BNC-5227161-9: CONN BNC JACK R/A 50 OHM PCB Description: BNC Connector Jack, Female Socket 50 Ohm Panel Mount, Through Hole, Right Angle Solder Technical Specifications: Connector Style: BNC Connector Type: Jack, Female Socket Contact Termination: Solder Shield Termination: Solder Impedance: 50 Ohm Mounting Type: Panel Mount, Through Hole, Right Angle Mounting Feature: Bulkhead - Front Side Nut Fastening Type: Bayonet Lock Frequency - Max: 4GHz Number of Ports: 1 Features: Board Guide, Isolated Housing Color: Black, Silver Body Material: Zinc Body Finish: Nickel Center Contact Plating: Gold Dielectric Material: Polymethylpentene (PMP) Operating Temperature: -55°C ~ 85°C Center Contact Material: Phosphor Bronze Voltage Rating: 500V Mating Cycles: 500 Datasheet(s): 5227161 Drawing <http://www.te.com/commerce/DocumentDelivery/DDEController?Action=srchrtrv&DocNm=5227161&DocType=Customer+Drawing&DocLang=English> Vendor(s): Digikey: A32261-ND <https://www.digikey.com/product-detail/en/te-connectivity-amp-connectors/5227161-9/A32261-ND/811159>; MANUFACTURER: TE Connectivity AMP Connectors; MPN: 5227161-9; VENDOR: Digikey; VLINK: https://www.digikey.com/product-detail/en/te-connectivity-amp-connectors/5227161-9/A32261-ND/811159; VPN: A32261-ND
J7-J9 = openag-connectors:ATLAS-STAMP; MPN: N/A
J10 = PFC_pi4:PFCEDU_V7_PI4_AI_CONNECTORS_2X20-RPI
J11 = openag-connectors:MOLEX_2P_1.25MM
J12 = openag-connectors:MOLEX_3P_1.25MM
JS1 JS2 = Ai_Connectors:1X02-SJ-NO: A.I. Device 1x02-SJ-* NC has a large amount of paste (see paste layer) so that it should jumper during reflow. Remember that we have a version with a buil-in trace, which needs to be cut in order to have the jumper be NO.
L1-L6 = openag-inductors:NR8040T101M; MANUFACTURER_PART_NUMBER: NR8040T101M; VENDOR: TAIYO YUDEN
LED1-LED24 = Tomaszewski:LED_W/THERM
LSP1-LSP12 = solpad:SE14: SOLDER PAD E1553, drill 1,4mm, distributor Buerklin, 07F820
Q1 = transistor-npn:BCF30*: NPN Transistor
Q2 = openag-driver-IC:DMN6140L-13; MANUFACTURER_PART_NUMBER: DMN6140L13; VENDOR: Diodes Inc
R1-R3 = Ai_Passives:RES; TOLERANCE: 5%
R4-R9 = openag-resistors:6.3OHM-RC0805FR-076R34L: Yageo - RC0805FR-076R34L - RES SMD 6.34 OHM 1% 1/8W 0805 Description: 6.34 Ohms ±1% 0.125W, 1/8W Chip Resistor 0805 (2012 Metric) Moisture Resistant Thick Film Technical Specifications: Resistance: 6.34 Ohms Tolerance: ±1% Power: 0.125W, 1/8W Temperature Coefficient: ±200ppm/°C Operating Temperature: -55°C ~ 155°C Packaging / Case: 0805 (2012 Metric) Datasheet(s): RC Series, L Datasheet Vendor(s): Digikey: 311-6.34CRCT-ND <https://www.digikey.com/product-detail/en/yageo/RC0805FR-076R34L/311-6.34CRCT-ND/731003>; POPULATE: YES; VERIFIED: NO
R10-R18 R20-R34 R36 R37 R39 R40 R42 R44 R45 R52-R63 = SparkFun-Resistors:10KOHM-1/10W-1%(0603): RES-00824; PROD_ID: RES-00824; VALUE: 10K
R19 = rcl:R-US_: RESISTOR, American symbol; SPICEPREFIX: R
R35 R38 R41 = SparkFun-Resistors:10KOHM-1/10W-1%(0603): RES-00824; PROD_ID: RES-00824
R43 = openag-resistors:1K-ERJ-PB3D1001V: RES SMD 1K OHM 0.5% 1/5W 0603 Description: 1 kOhms ±0.5% 0.2W, 1/5W Chip Resistor 0603 (1608 Metric) Automotive AEC-Q200, Pulse Withstanding Thick Film Technical Specifications: Resistance: 1 kOhms Tolerance: ±0.5% Power: 0.2W, 1/5W Operating Temperature: -55°C ~ 155°C Package / Case: 0603 (1608 Metric) Datasheet(s): ERJ-PB3, PB6 Series, High Precision Datasheet <https://industrial.panasonic.com/cdbs/www-data/pdf/RDM0000/AOA0000C328.pdf> Vendor(s): Digikey: P20283CT-ND <https://www.digikey.com/product-detail/en/panasonic-electronic-components/ERJ-PB3D1001V/P20283CT-ND/6214538>; MANUFACTURER: Panasonic; MPN: P20283CT-ND; VENDOR: Digikey; VLINK: https://www.digikey.com/product-detail/en/panasonic-electronic-components/ERJ-PB3D1001V/P20283CT-ND/6214538; VPN: P20283CT-ND
R46-R51 = openag-resistors:1K-ERJ-PB3D1001V: RES SMD 1K OHM 0.5% 1/5W 0603 Description: 1 kOhms ±0.5% 0.2W, 1/5W Chip Resistor 0603 (1608 Metric) Automotive AEC-Q200, Pulse Withstanding Thick Film Technical Specifications: Resistance: 1 kOhms Tolerance: ±0.5% Power: 0.2W, 1/5W Operating Temperature: -55°C ~ 155°C Package / Case: 0603 (1608 Metric) Datasheet(s): ERJ-PB3, PB6 Series, High Precision Datasheet <https://industrial.panasonic.com/cdbs/www-data/pdf/RDM0000/AOA0000C328.pdf> Vendor(s): Digikey: P20283CT-ND <https://www.digikey.com/product-detail/en/panasonic-electronic-components/ERJ-PB3D1001V/P20283CT-ND/6214538>; MANUFACTURER: Panasonic; MPN: P20283CT-ND; VALUE: 1K; VENDOR: Digikey; VLINK: https://www.digikey.com/product-detail/en/panasonic-electronic-components/ERJ-PB3D1001V/P20283CT-ND/6214538; VPN: P20283CT-ND
R64-R67 = openag-resistors:100OHM-RC0603JR-07100RL: RES SMD 100 OHM 5% 1/10W 0603 Description: 100 Ohms ±5% 0.1W, 1/10W Chip Resistor 0603 (1608 Metric) Moisture Resistant Thick Film Technical Specifications: Resistance: 100 Ohms Tolerance: ±5% Power (Watts): 0.1W, 1/10W Composition: Thick Film Features: Moisture Resistant Temperature Coefficient: ±100ppm/°C Operating Temperature: -55°C ~ 155°C Package / Case: 0603 (1608 Metric) Supplier Device Package: 0603 Size / Dimension: 0.063" L x 0.032" W (1.60mm x 0.80mm) Height - Seated (Max): 0.022" (0.55mm) Number of Terminations: 2 Datasheet(s): Thick Film Chip Resistor Intro <http://www.yageo.com.tw/exep/pages/download/literatures/PYu-R_INT-thick_7.pdf> Chip Resistor Marking <http://www.yageo.com/exep/pages/download/literatures/PYu-R_Marking_2.pdf> RC Series, L Datasheet <http://www.yageo.com/documents/recent/PYu-RC_Group_51_RoHS_L_8.pdf> Vendor(s): Digikey: 311-100GRCT-ND <https://www.digikey.com/product-detail/en/yageo/RC0603JR-07100RL/311-100GRCT-ND/729644>; MANUFACTURER: Yageo; MPN: RC0603JR-07100RL; VALUE: 100; VENDOR: Digikey; VLINK: https://www.digikey.com/product-detail/en/yageo/RC0603JR-07100RL/311-100GRCT-ND/729644; VPN: 311-100GRCT-ND
R68 = openag-resistors:4.7K-RC1206JR-074K7L: Yageo - RC1206JR-074K7L - RES SMD 4.7K OHM 5% 1/4W 1206 Description: 4.7 kOhms ±5% 0.25W, 1/4W Chip Resistor 1206 (3216 Metric) Moisture Resistant Thick Film Technical Specifications: Resistance: 4.7 kOhms Tolerance: ±5% Power (Watts): 0.25W, 1/4W Composition: Thick Film Features: Moisture Resistant Temperature Coefficient: ±100ppm/°C Operating Temperature: -55°C ~ 155°C Package / Case: 1206 (3216 Metric) Supplier Device Package: 1206 Size / Dimension: 0.122" L x 0.063" W (3.10mm x 1.60mm) Height - Seated (Max): 0.026" (0.65mm) Number of Terminations: 2 Datasheet(s): Thick Film Chip Resistor Intro <http://www.yageo.com.tw/exep/pages/download/literatures/PYu-R_INT-thick_7.pdf> Chip Resistor Marking <http://www.yageo.com/exep/pages/download/literatures/PYu-R_Marking_2.pdf> RC Series, L Datasheet <http://www.yageo.com/documents/recent/PYu-RC_Group_51_RoHS_L_8.pdf> Vendor(s): Digikey: 311-4.7KERCT-ND <https://www.digikey.com/product-detail/en/yageo/RC1206JR-074K7L/311-4.7KERCT-ND/732242>; POPULATE: YES; VALUE: 4.7K; VERIFIED: NO
SJ1 SJ2 = openag-connectors:SOLDERJUMPER: SMD Solder JUMPER Solder the two pads together to create a connection, or remove the solder to break it. REFLOW - Use this footprint for solder paste and reflow ovens. WAVE - Use this footprint for hand-soldering (larger pads). CLOSED - Has a trace between the two pads to ensure it is closed by default. The trace needs to be cut to disable the jumper, and can be closed again by creating a solder bridge between the two pads.; MPN: N/A
TP38-TP41 TP99-TP101 TP104-TP107 TP112-TP141 = openag-testpads:TP: Test pad; MPN: N/A
U1 = Ai_IC:24LC32A
U2-U7 = openag-driver-IC:AL8861: AL8861 LED Driver IC Description: IC LED DRVR REG PWM 1.5A SOT89-5 Technical Specifications: Type: IC Voltage In: 4.5V - 40V Current Out: Up to 1.5A Frequency: 1Mhz Dimming: PWM or Analog Package SOT-89-5 Operating Temperature: -40°C ~ 85°C (TA) Datasheet(s): Diodes AL8861 <https://www.mouser.com/ds/2/115/AL8861-1094677.pdf> Vendor(s): Digikey: Diodes AL8861 <https://www.digikey.com/product-detail/en/diodes-incorporated/AL8861Y-13/AL8861Y-13DICT-ND/6702378>
U8 = openag-driver-IC:ADT7470ARQZ-REEL; MANUFACTURER_PART_NUMBER: ADT7470ARQZREEL; VENDOR: Analog Devices Inc
U9 = openag-sensors:TMP05AKSZ-500RL7; MANUFACTURER_PART_NUMBER: TMP05AKSZ500RL7; VENDOR: Analog Devices Inc
U10 = OpenAG_I2C:TCA9548APWR; MANUFACTURER_PART_NUMBER: TCA9548APWR; VENDOR: TEXAS INSTRUMENTS
U11 = openag-dacs:DAC5578SPW: IC DAC 8BIT I2C OCTAL 16TSSOP Description: 8 Bit Digital to Analog Converter 8 16-TSSOP Technical Specifications: Number of Bits: 8 Number of D/A Converters: 8 Settling Time: 12µs (Typ) Output Type: Voltage - Buffered Differential Output: No Data Interface: I²C Reference Type: External Voltage - Supply, Analog: 2.7 V ~ 5.5 V Voltage - Supply, Digital: 2.7 V ~ 5.5 V INL/DNL (LSB): ±0.01, ±0.01 Architecture: String DAC Operating Temperature: -40°C ~ 125°C Package / Case: 16-TSSOP (0.173", 4.40mm Width) Supplier Device Package: 16-TSSOP Base Part Number: DAC5578 Datasheet(s): DAC5578,6578,7578 <http://www.ti.com/lit/ds/symlink/dac5578.pdf> Analog Signal Chain Guide <http://www.ti.com/lit/pdf/slyb174> Vendor(s): Digikey: 296-27736-5-ND <https://www.digikey.com/product-detail/en/texas-instruments/DAC5578SPW/296-27736-5-ND/2360827>; MANUFACTURER: Texas Instruments; MPN: DAC5578SPW; VENDOR: Digikey; VLINK: https://www.digikey.com/product-detail/en/texas-instruments/DAC5578SPW/296-27736-5-ND/2360827; VPN: 296-27736-5-ND
U12 = openag-driver-IC:UCC27517DBVR; MANUFACTURER_PART_NUMBER: UCC27517DBVR; VENDOR: Texas Instruments
U14-U16 = openag-regulators:R-78E5.0-1.0: DC/DC CONVERTER 5V 5W Description: Linear Regulator Replacement DC DC Converter 1 Output 5V 1A 8V - 28V Input Technical Specifications: Type: Linear Regulator Replacement Number of Outputs: 1 Voltage - Input (Min): 8V Voltage - Input (Max): 28V Voltage - Output 1: 5V Current - Output (Max): 1A Power (Watts): 5W Applications: ITE (Commercial) Features: SCP Operating Temperature: -40°C ~ 85°C Efficiency: 91% Mounting Type: Through Hole Package / Case: 3-SIP Module Size / Dimension: 0.46" L x 0.33" W x 0.41" H (11.6mm x 8.5mm x 10.4mm) Datasheet(s): R-78E-1.0 Series Datasheet <https://www.recom-power.com/pdf/Innoline/R-78Exx-1.0.pdf> Vendor(s): Digikey: 945-2201-ND <https://www.digikey.com/product-detail/en/recom-power/R-78E5.0-1.0/945-2201-ND/4930585>; MANUFACTURER: Recom Power; MPN: R-78E5.0-1.0; VENDOR: Digikey; VLINK: https://www.digikey.com/product-detail/en/recom-power/R-78E5.0-1.0/945-2201-ND/4930585; VPN: 945-2201-ND
U17 = openag-sensors:CCS811: ams - CCS811 - LOW POWER DIGITAL SENSOR FOR IND Description: Air Quality Sensor I²C Technical Specifications: Type: Air Quality Output: I²C Operating Temperature: -5°C ~ 50°C Voltage - Supply: 1.8 V ~ 3.6 V Current - Supply: 26mA Datasheet(s): CCS811 Datasheet <http://ams.com/eng/content/download/951091/2269479/471718> CCS811 Factsheet <http://ams.com/eng/content/view/download/490399> Vendor(s): Digikey: CCS811CT-ND <https://www.digikey.com/product-detail/en/ams/CCS811/CCS811CT-ND/6569300>; POPULATE: YES; VERIFIED: NO
U18 = openag-sensors:SHT25: SENSOR HUMI/TEMP 3V I2C 1.8% SMD Description: Humidity Temperature Sensor 0 ~ 100% RH I²C ±1.8% RH 8s Surface Mount Technical Specifications: Sensor Type: Humidity, Temperature Humidity Range: 0 ~ 100% RH Output Type: I²C Output: 12b Accuracy: ±1.8% RH Response Time: 8s Voltage - Supply: 2.1 V ~ 3.6 V Mounting Type: Surface Mount Operating Temperature: -40°C ~ 125°C Datasheet(s): SHTxx Testing Guide <https://www.sensirion.com/fileadmin/user_upload/customers/sensirion/Dokumente/2_Humidity_Sensors/Sensirion_Humidity_Sensors_Testing_Guide_V1.2.pdf> SHTxx Handling Instructions <https://www.sensirion.com/fileadmin/user_upload/customers/sensirion/Dokumente/2_Humidity_Sensors/Sensirion_Humidity_Sensors_Handling_Instructions_V4.pdf> Sensor Specification Statement <https://www.sensirion.com/fileadmin/user_upload/customers/sensirion/Dokumente/2_Humidity_Sensors/Sensirion_Humidity_Sensors_Specification_Statement_V1.pdf> SHTxx, STSxx Assembly SMD Pkgs <https://www.sensirion.com/fileadmin/user_upload/customers/sensirion/Dokumente/2_Humidity_Sensors/Sensirion_Humidity_Sensors_Handling_of_SMD_Packages_V1.pdf> SHT25 Datasheet <https://www.sensirion.com/fileadmin/user_upload/customers/sensirion/Dokumente/2_Humidity_Sensors/Sensirion_Humidity_Sensors_SHT25_Datasheet_V3.pdf> Vendor(s): Digikey: 1649-1008-1-ND <https://www.digikey.com/product-detail/en/sensirion-ag/SHT25/1649-1008-1-ND/5872290>; MANUFACTURER: Sensirion AG; MPN: SHT25; VENDOR: Digikey; VLINK: https://www.digikey.com/product-detail/en/sensirion-ag/SHT25/1649-1008-1-ND/5872290; VPN: 1649-1008-1-ND
U19-U21 = openag-isolators:ISO1540DR: DGTL ISO 2.5KV 2CH I2C 8SOIC Description: I²C Digital Isolator 2500Vrms 2 Channel 1Mbps 25kV/µs CMTI 8-SOIC (0.154", 3.90mm Width) Technical Specifications: Technology: Capacitive Coupling Type: I²C Number of Channels: 2 Channel Type: Bidirectional Voltage-Isolation: 2500Vrms Voltage - Supply: 3 V ~ 5.5 V Data Rate: 1Mbps Operating Temperature: -40°C ~ 125°C Package / Case: 8-SOIC (0.154", 3.90mm Width) Max Supply Current (3V ≤ VCC1, VCC2 ≤ 3.6V) Side 1, Side 2: 3.8mA, 3.1mA Datasheet(s): ISO154x <http://www.ti.com/lit/ds/symlink/iso1540.pdf> Vendor(s): Digikey: 296-34871-1-ND <https://www.digikey.com/product-detail/en/texas-instruments/ISO1540DR/296-34871-1-ND/3587214>; MANUFACTURER: Texas Instruments; MPN: ISO1540DR; VENDOR: Digikey; VLINK: https://www.digikey.com/product-detail/en/texas-instruments/ISO1540DR/296-34871-1-ND/3587214; VPN: 296-34871-1-ND
U22-U24 = openag-isolators:RM3.33.3S: CONV DC/DC 0.25W SGL 3.3VOUT SIP Description: Isolated Module DC DC Converter 1 Output 3.3V 76mA 3V - 3.6V Input Technical Specifications: Type: Isolated Module Number of Outputs: 1 Voltage - Input (Min): 3V Voltage - Input (Max): 3.6V Voltage - Output 1: 3.3V Current - Output (Max): 76mA Power (Watts): 250mW Voltage - Isolation: 1kV Applications: ITE (Commercial) Features: SCP Operating Temperature: -40°C ~ 85°C Efficiency: 70% Mounting Type: Through Hole Package / Case: 4-SIP Module Size / Dimension: 0.45" L x 0.24" W x 0.39" H (11.5mm x 6.0mm x 10.0mm) Datasheet(s): RM Series Datasheet <https://www.recom-power.com/pdf/Econoline/RM.pdf> Vendor(s): Digikey: 945-1212-ND <https://www.digikey.com/product-detail/en/recom-power/RM-3.33.3S/945-1212-ND/2256392>; MANUFACTURER: Recom Power; MPN: RM-3.33.3S; VENDOR: Digikey; VLINK: https://www.digikey.com/product-detail/en/recom-power/RM-3.33.3S/945-1212-ND/2256392; VPN: 945-1212-ND
U25-U28 = openag-driver-IC:PCA9633DP1; MANUFACTURER_PART_NUMBER: PCA9633DP1; VENDOR: NXP
W11 W12 = openag-connectors:PHOENIX_2P

## Net classes
0 default: width 0.102 mm, drill 0.254 mm, clearance 0.254 mm
1 vcc: width 0.178 mm